# EAGLE design duckypad (EAGLE 9.6.2)
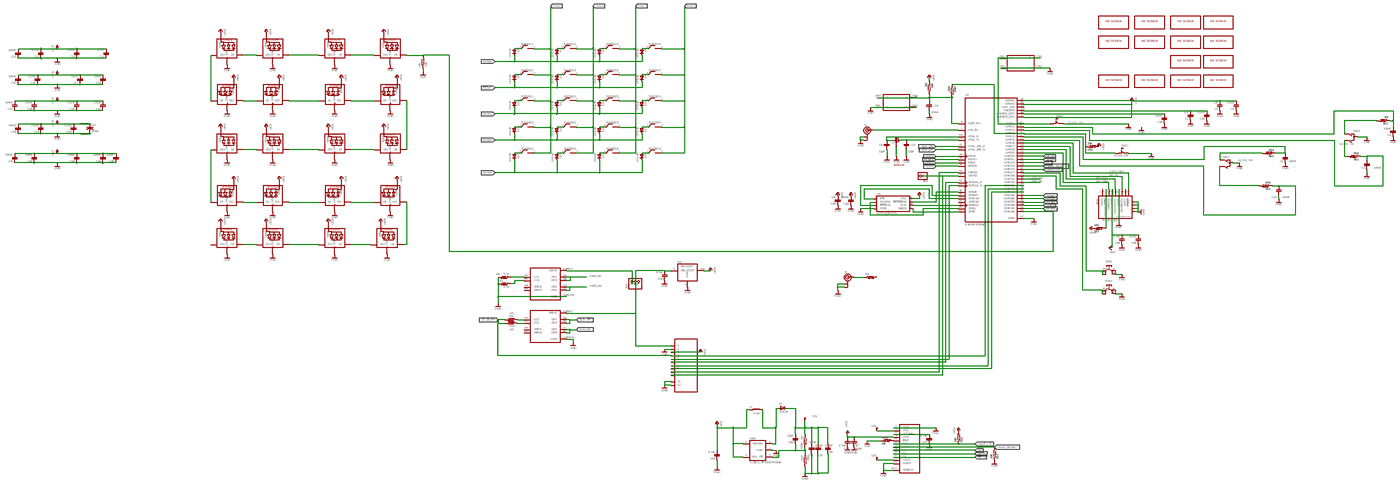
[diagram p0: schematic, sheet 1, overview]
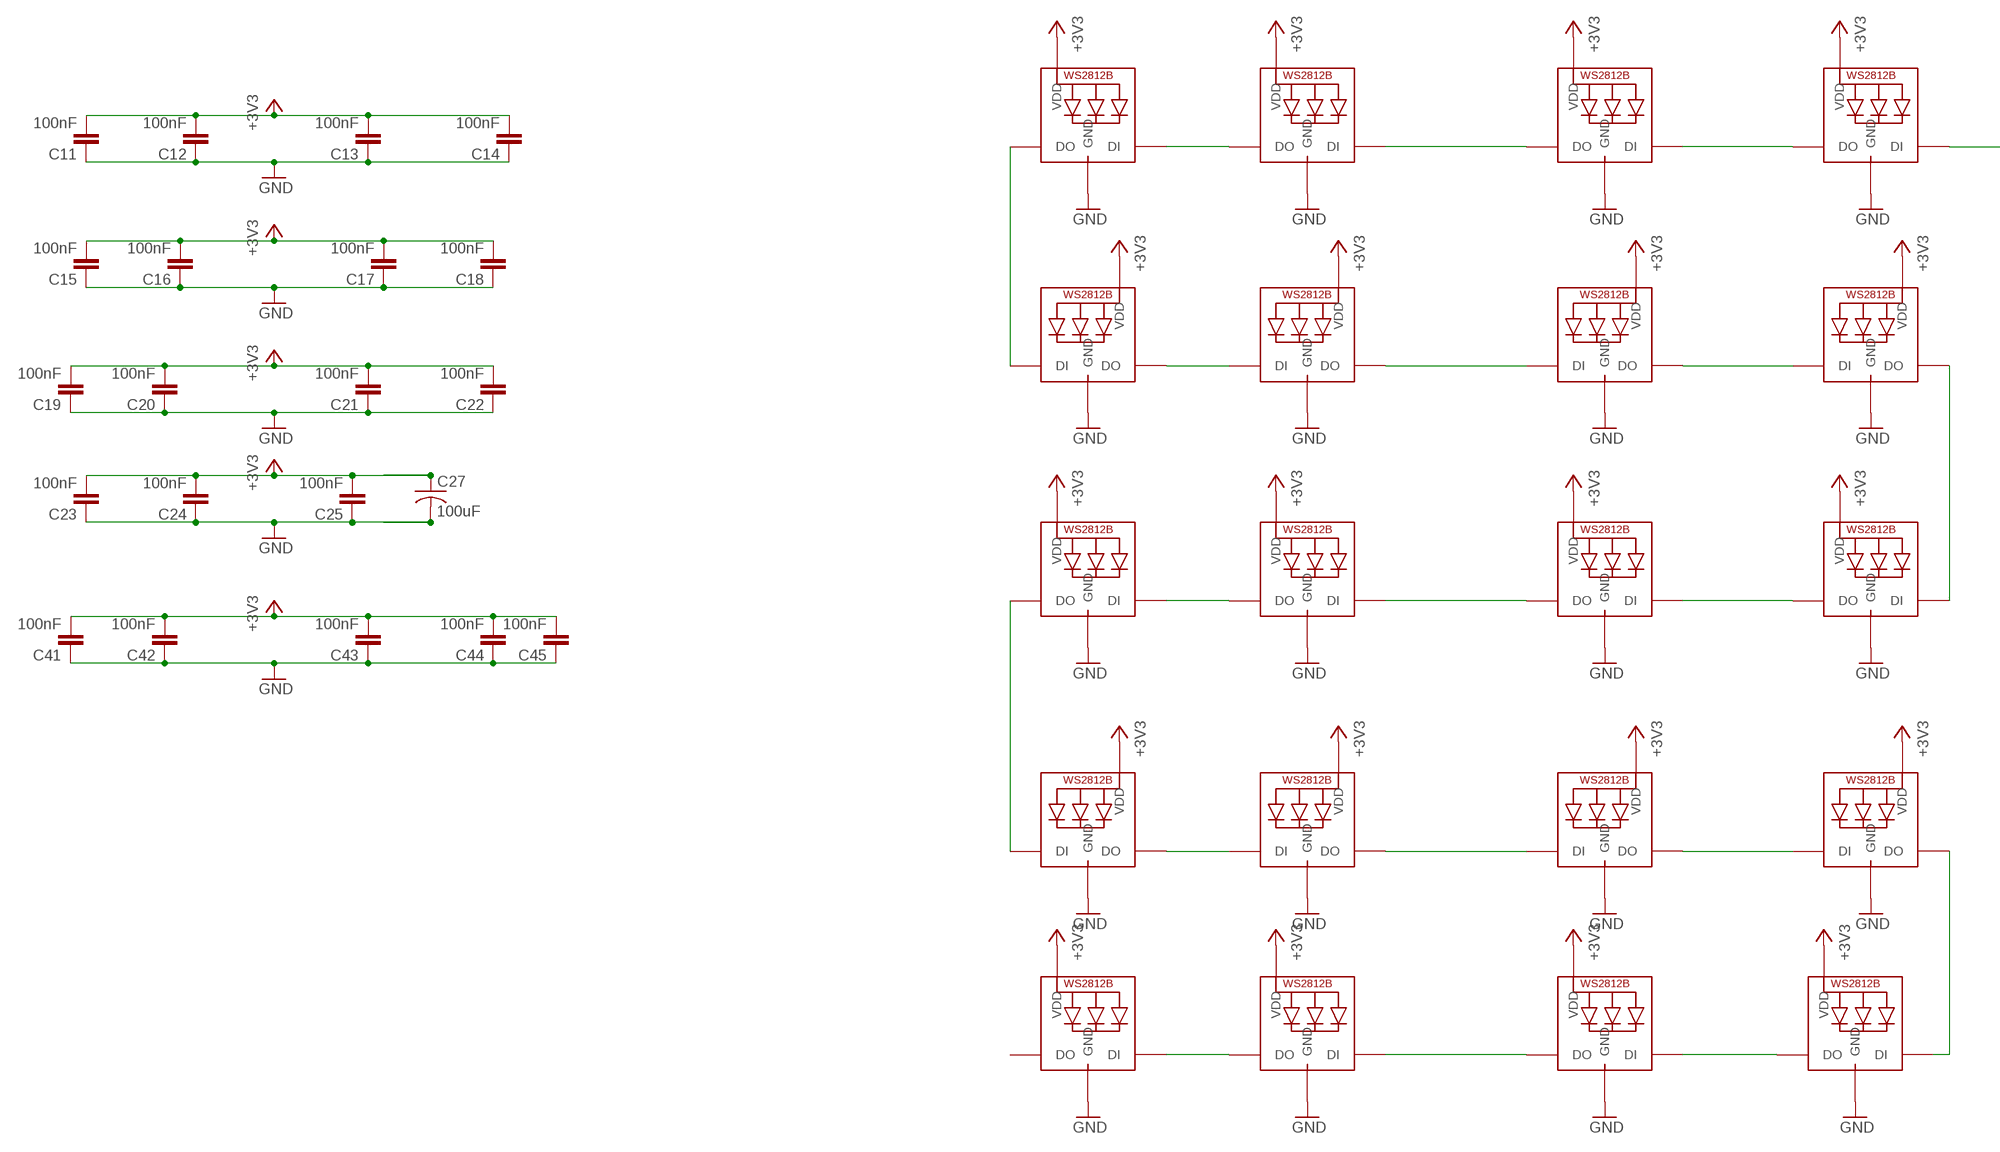
[diagram p1: schematic, sheet 1, part 1 of 4]
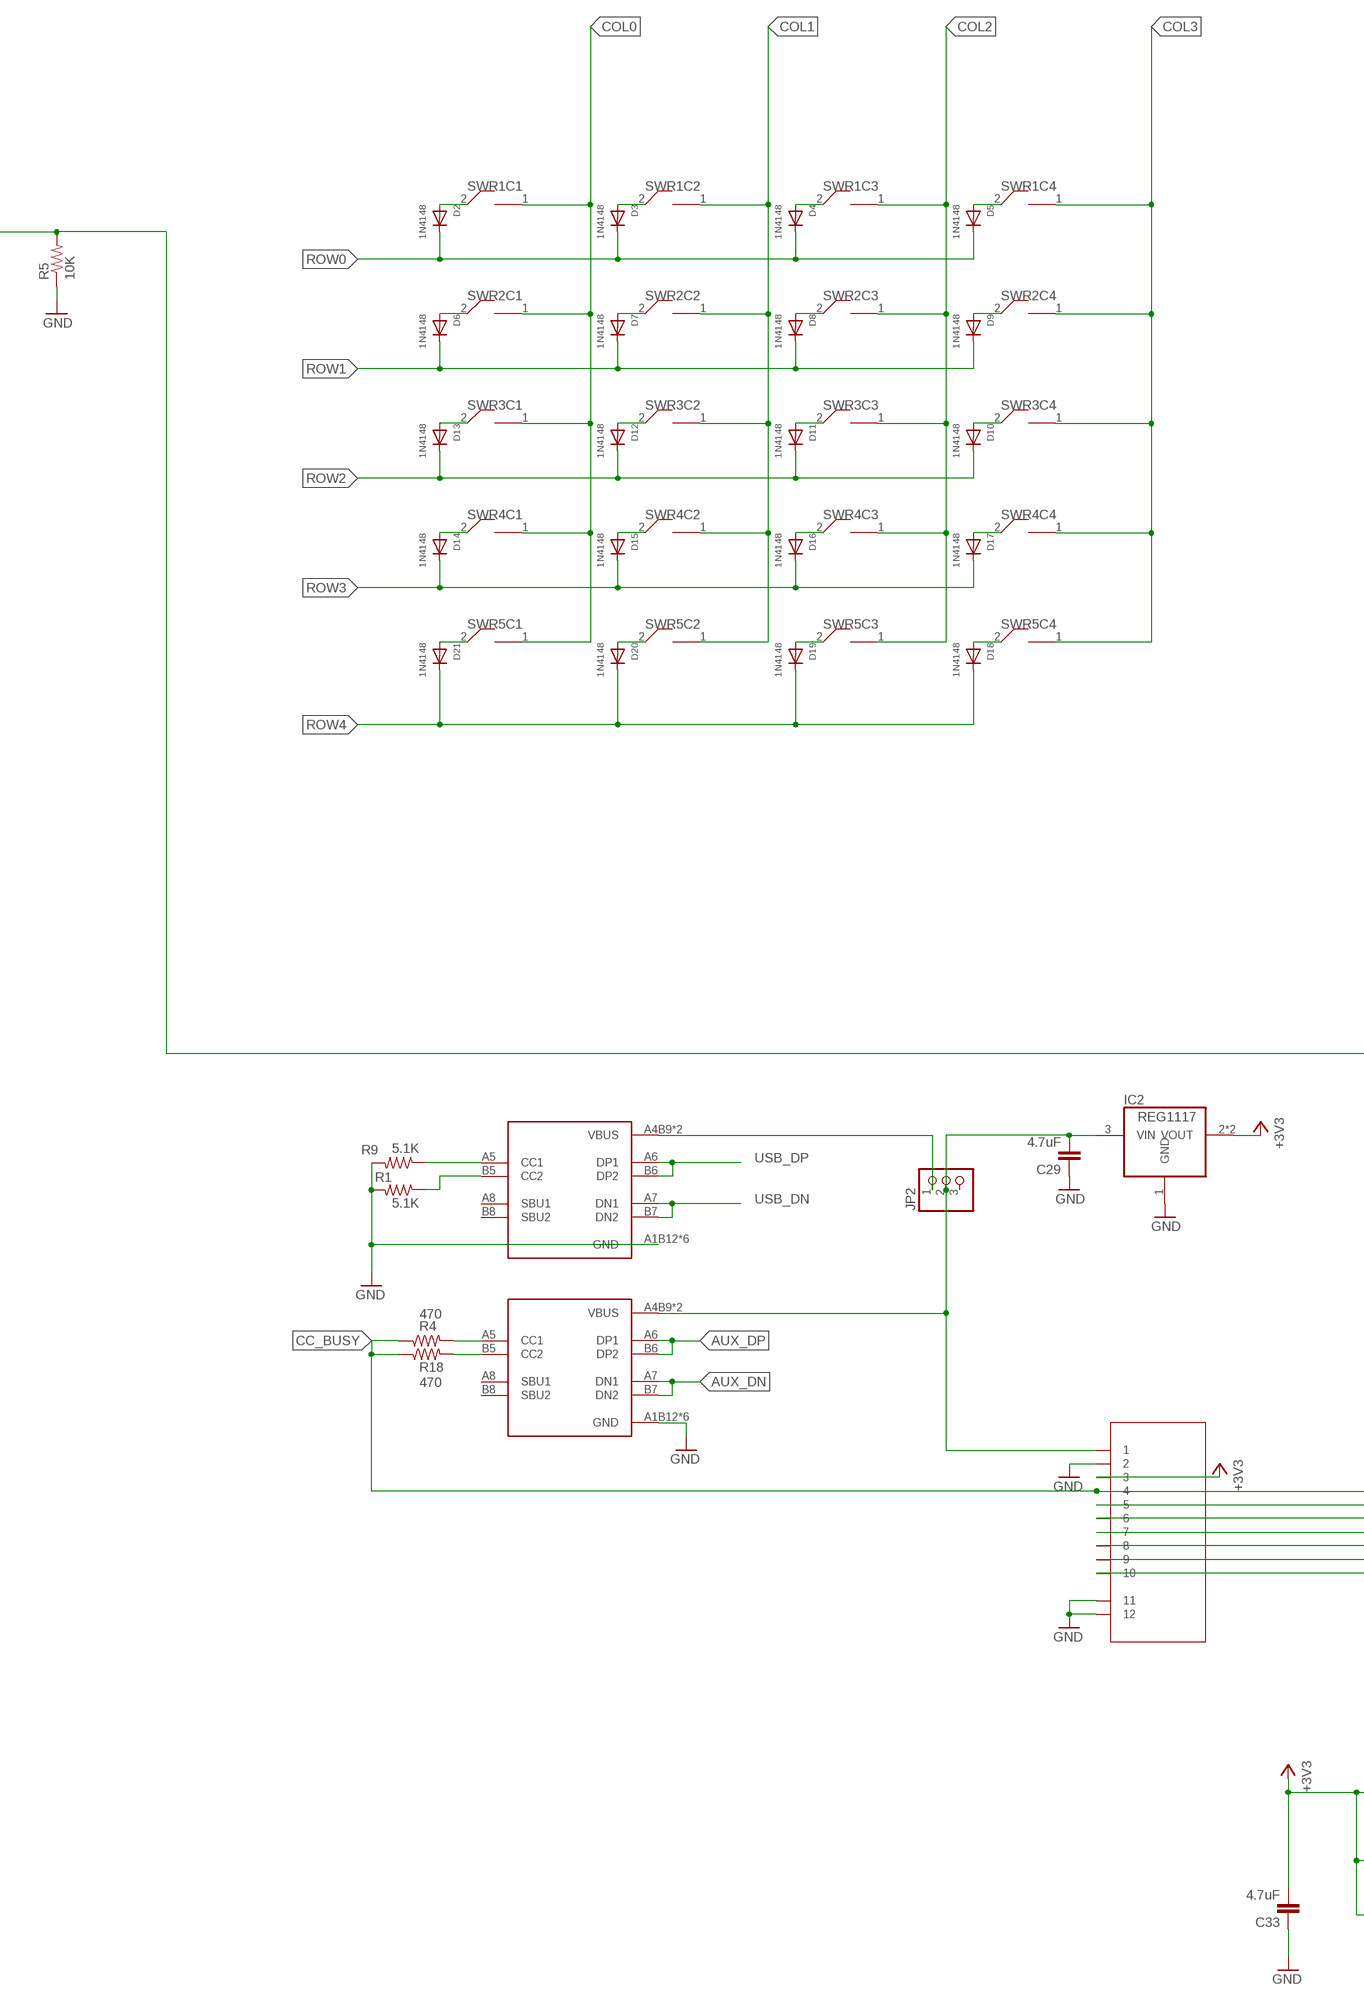
[diagram p2: schematic, sheet 1, part 2 of 4]
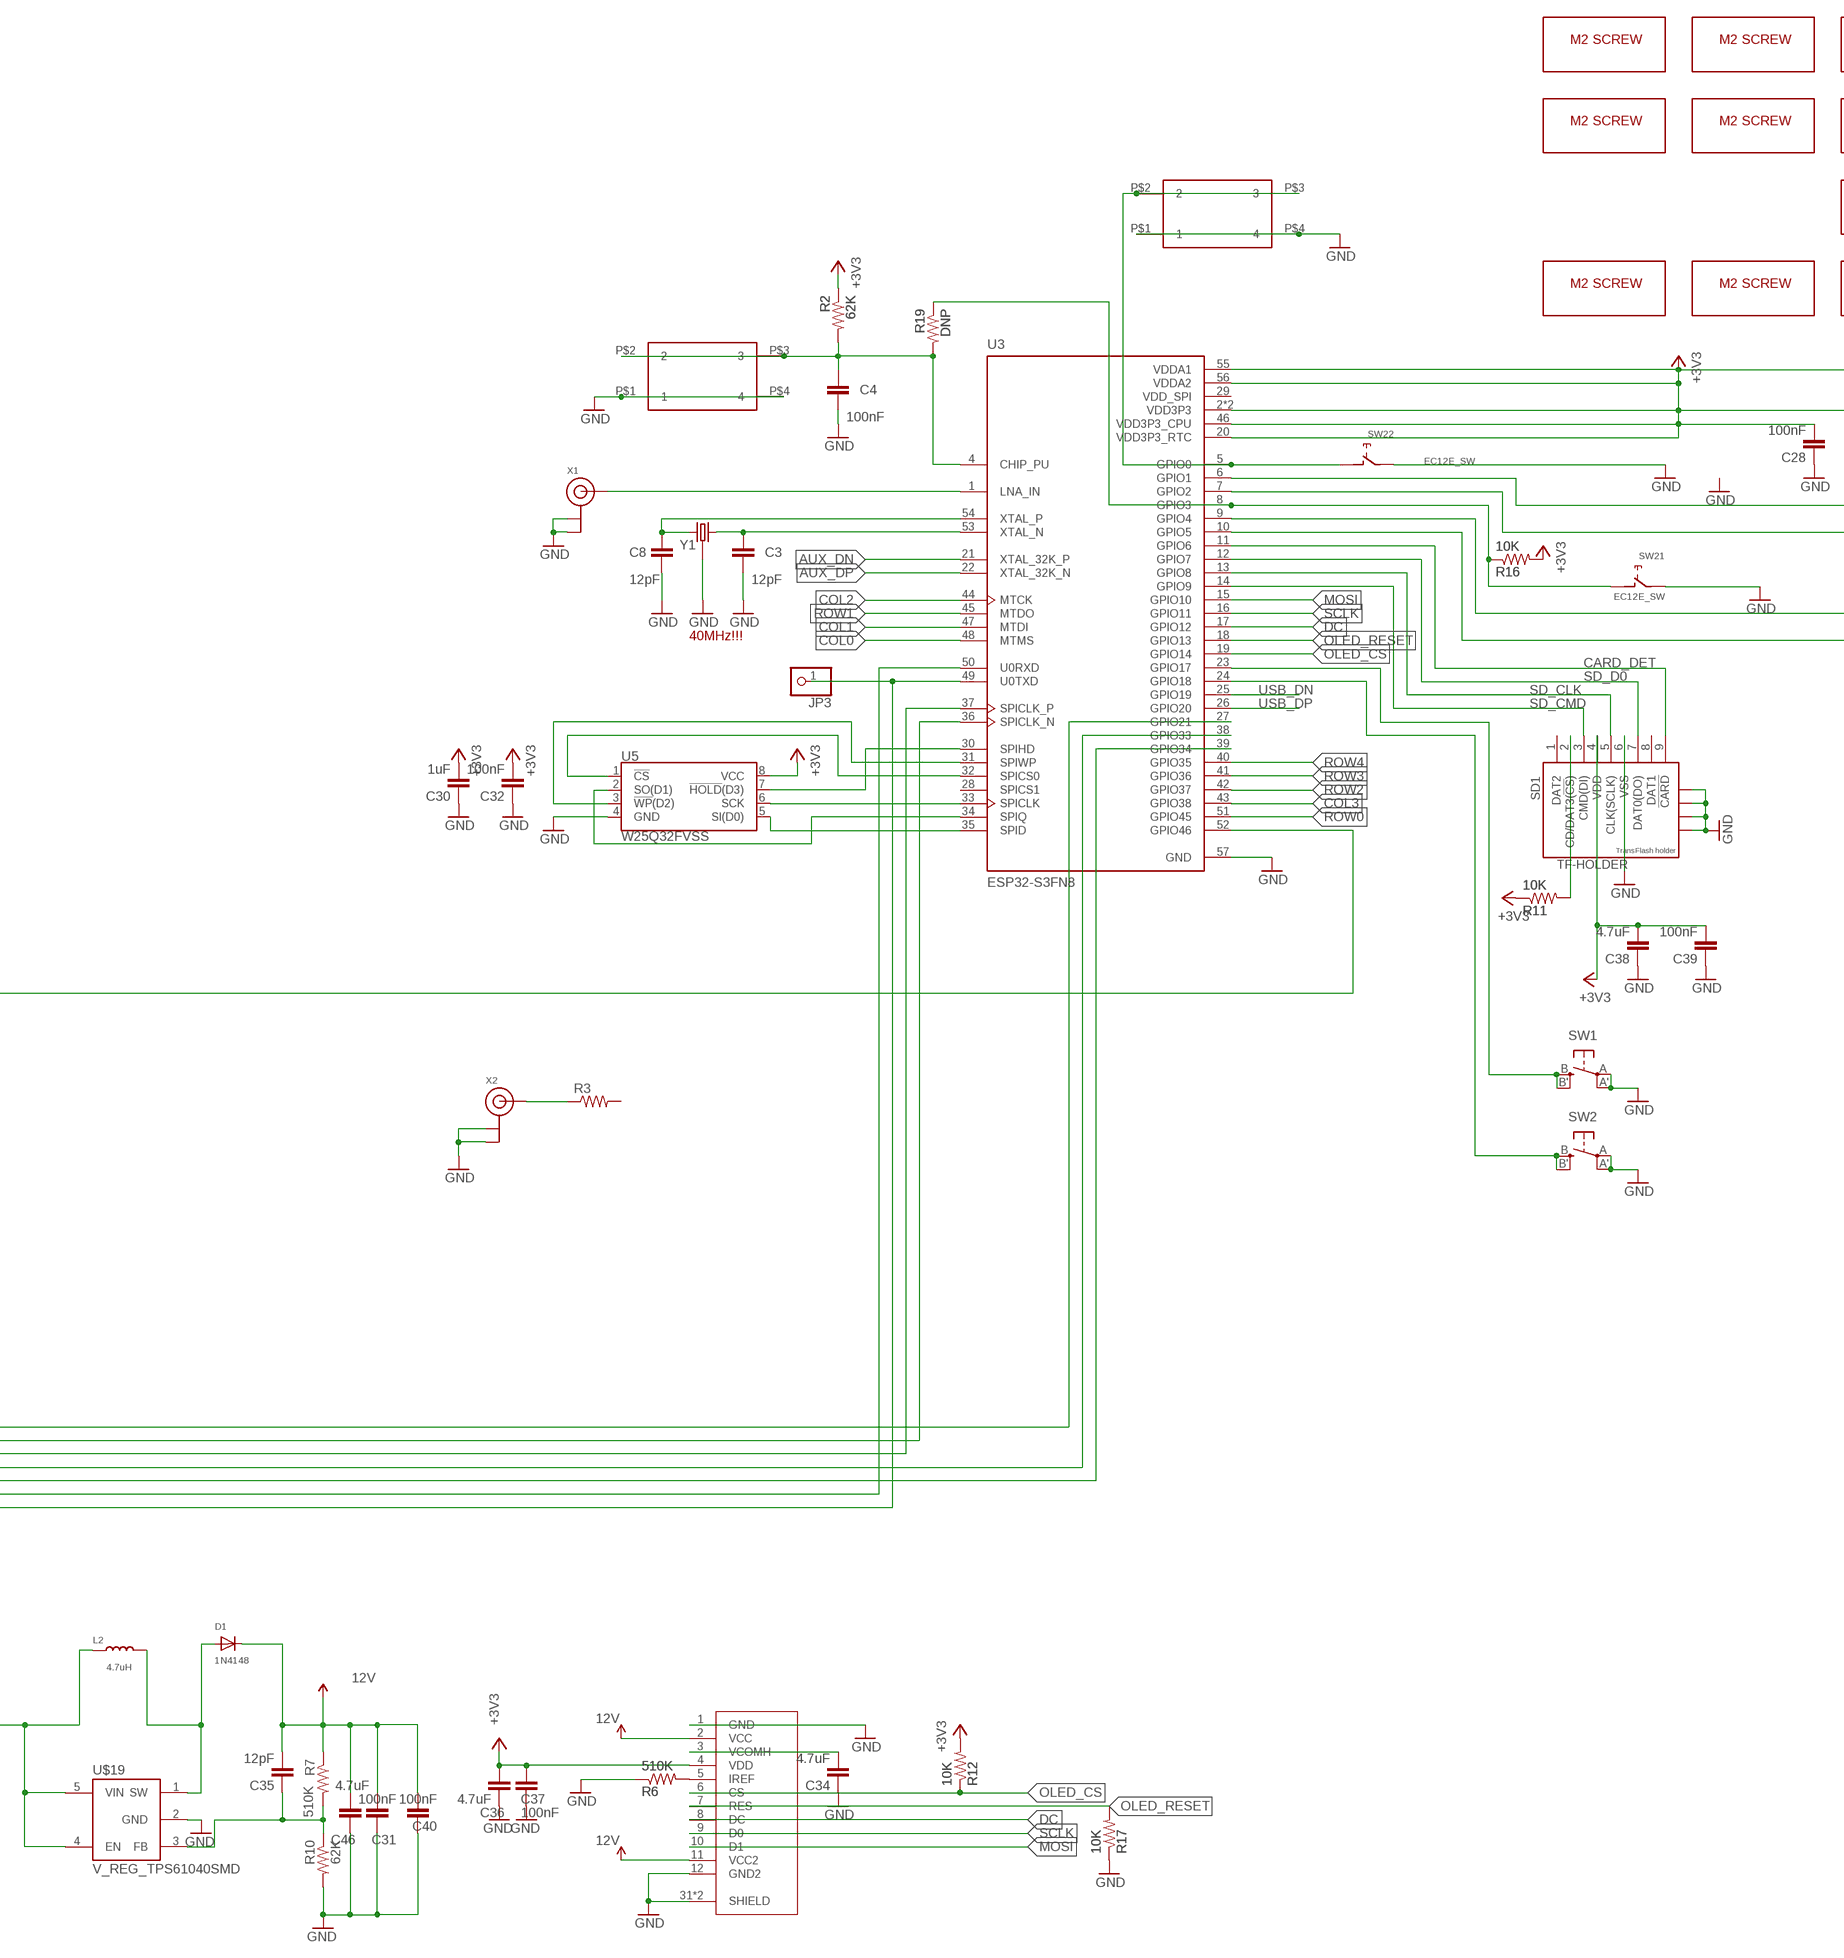
[diagram p3: schematic, sheet 1, part 3 of 4]
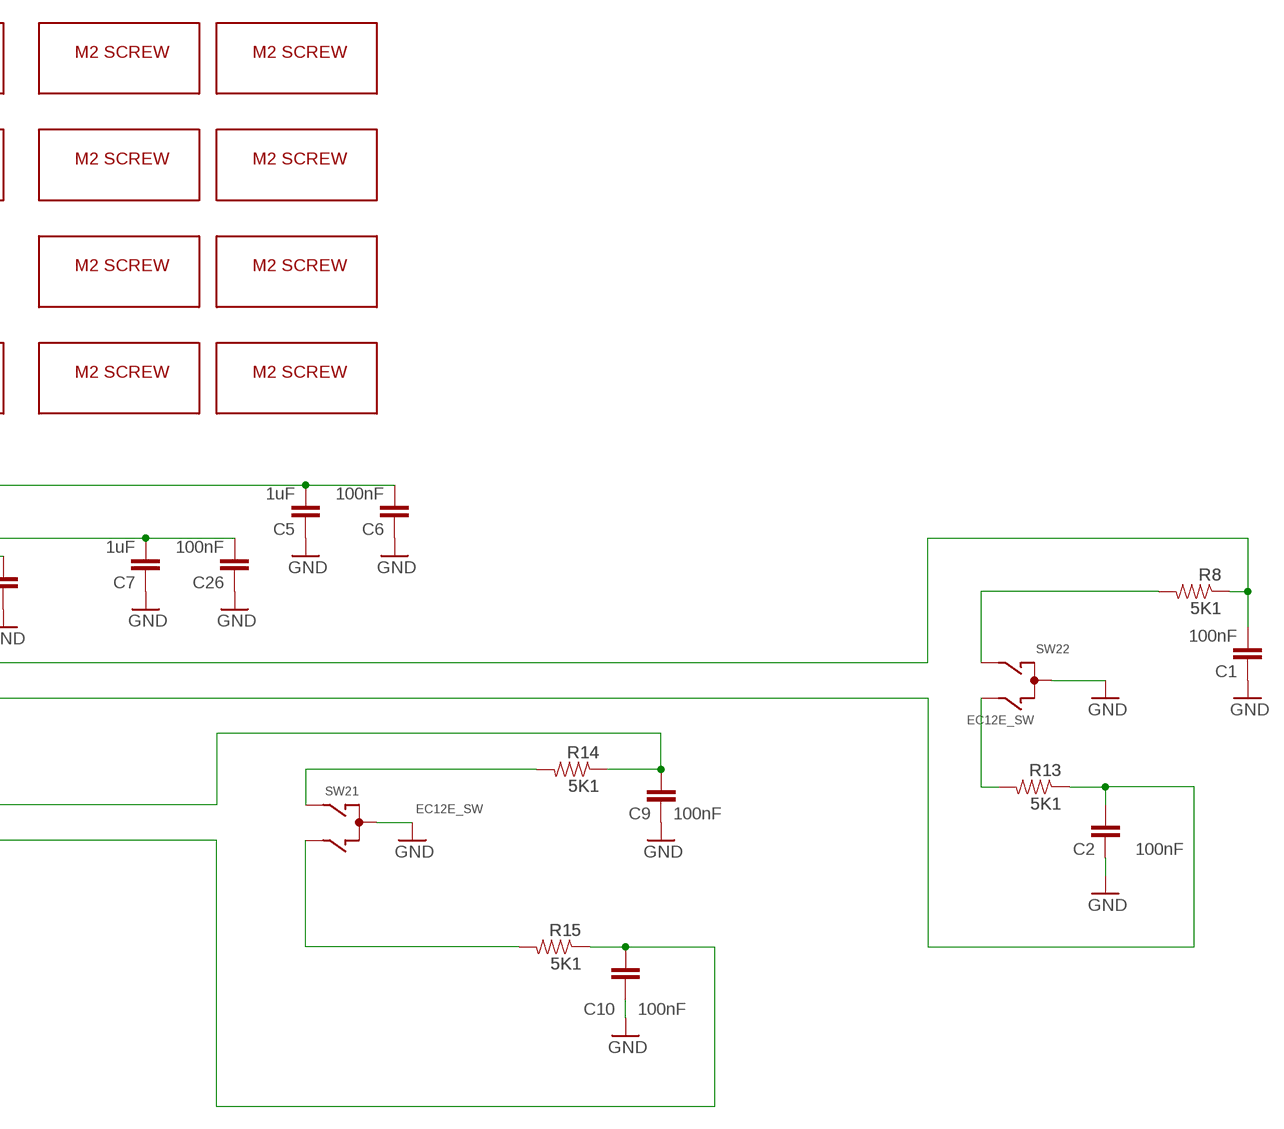
[diagram p4: schematic, sheet 1, part 4 of 4]

## Parts
C1  100nF  CAP0805  [0805]
C2  100nF  CAP0805  [0805]
C3  12pF  CAP0805  [0805]
C4  100nF  CAP0805  [0805]
C5  1uF  CAP0805  [0805]
C6  100nF  CAP0805  [0805]
C7  1uF  CAP0805  [0805]
C8  12pF  CAP0805  [0805]
C9  100nF  CAP0805  [0805]
C10  100nF  CAP0805  [0805]
C11  100nF  CAP0805  [0805]
C12  100nF  CAP0805  [0805]
C13  100nF  CAP0805  [0805]
C14  100nF  CAP0805  [0805]
C15  100nF  CAP0805  [0805]
C16  100nF  CAP0805  [0805]
C17  100nF  CAP0805  [0805]
C18  100nF  CAP0805  [0805]
C19  100nF  CAP0805  [0805]
C20  100nF  CAP0805  [0805]
C21  100nF  CAP0805  [0805]
C22  100nF  CAP0805  [0805]
C23  100nF  CAP0805  [0805]
C24  100nF  CAP0805  [0805]
C25  100nF  CAP0805  [0805]
C26  100nF  CAP0805  [0805]
C27  100uF  C-USC1210  [C1210]
C28  100nF  CAP0805  [0805]
C29  4.7uF  CAP0805  [0805]
C30  1uF  CAP0805  [0805]
C31  100nF  CAP0805  [0805]
C32  100nF  CAP0805  [0805]
C33  4.7uF  CAP0805  [0805]
C34  4.7uF  CAP0805  [0805]
C35  12pF  CAP0805  [0805]
C36  4.7uF  CAP0805  [0805]
C37  100nF  CAP0805  [0805]
C38  4.7uF  CAP0805  [0805]
C39  100nF  CAP0805  [0805]
C40  100nF  CAP0805  [0805]
C41  100nF  CAP0805  [0805]
C42  100nF  CAP0805  [0805]
C43  100nF  CAP0805  [0805]
C44  100nF  CAP0805  [0805]
C45  100nF  CAP0805  [0805]
C46  4.7uF  CAP0805  [0805]
D1  1N4148  ADAFRUIT_CHANGED_DIODESOD-123  [ADAFRUIT_CHANGED_SOD-123]
D2  1N4148  ADAFRUIT_CHANGED_DIODESOD-123  [ADAFRUIT_CHANGED_SOD-123]
D3  1N4148  ADAFRUIT_CHANGED_DIODESOD-123  [ADAFRUIT_CHANGED_SOD-123]
D4  1N4148  ADAFRUIT_CHANGED_DIODESOD-123  [ADAFRUIT_CHANGED_SOD-123]
D5  1N4148  ADAFRUIT_CHANGED_DIODESOD-123  [ADAFRUIT_CHANGED_SOD-123]
D6  1N4148  ADAFRUIT_CHANGED_DIODESOD-123  [ADAFRUIT_CHANGED_SOD-123]
D7  1N4148  ADAFRUIT_CHANGED_DIODESOD-123  [ADAFRUIT_CHANGED_SOD-123]
D8  1N4148  ADAFRUIT_CHANGED_DIODESOD-123  [ADAFRUIT_CHANGED_SOD-123]
D9  1N4148  ADAFRUIT_CHANGED_DIODESOD-123  [ADAFRUIT_CHANGED_SOD-123]
D10  1N4148  ADAFRUIT_CHANGED_DIODESOD-123  [ADAFRUIT_CHANGED_SOD-123]
D11  1N4148  ADAFRUIT_CHANGED_DIODESOD-123  [ADAFRUIT_CHANGED_SOD-123]
D12  1N4148  ADAFRUIT_CHANGED_DIODESOD-123  [ADAFRUIT_CHANGED_SOD-123]
D13  1N4148  ADAFRUIT_CHANGED_DIODESOD-123  [ADAFRUIT_CHANGED_SOD-123]
D14  1N4148  ADAFRUIT_CHANGED_DIODESOD-123  [ADAFRUIT_CHANGED_SOD-123]
D15  1N4148  ADAFRUIT_CHANGED_DIODESOD-123  [ADAFRUIT_CHANGED_SOD-123]
D16  1N4148  ADAFRUIT_CHANGED_DIODESOD-123  [ADAFRUIT_CHANGED_SOD-123]
D17  1N4148  ADAFRUIT_CHANGED_DIODESOD-123  [ADAFRUIT_CHANGED_SOD-123]
D18  1N4148  ADAFRUIT_CHANGED_DIODESOD-123  [ADAFRUIT_CHANGED_SOD-123]
D19  1N4148  ADAFRUIT_CHANGED_DIODESOD-123  [ADAFRUIT_CHANGED_SOD-123]
D20  1N4148  ADAFRUIT_CHANGED_DIODESOD-123  [ADAFRUIT_CHANGED_SOD-123]
D21  1N4148  ADAFRUIT_CHANGED_DIODESOD-123  [ADAFRUIT_CHANGED_SOD-123]
IC2  REG1117  [SOT223]
JP2  PINHD-1X3CB  [1X03-CLEANBIG]
JP3  PINHD-1X1CB  [1X01-CLEANBIG]
L2  4.7uH  L-4030  [L4030]
LED_R1C1  WS2812B  [REVERSE_MNT]
LED_R1C2  WS2812B  [REVERSE_MNT]
LED_R1C3  WS2812B  [REVERSE_MNT]
LED_R1C4  WS2812B  [REVERSE_MNT]
LED_R2C1  WS2812B  [REVERSE_MNT]
LED_R2C2  WS2812B  [REVERSE_MNT]
LED_R2C3  WS2812B  [REVERSE_MNT]
LED_R2C4  WS2812B  [REVERSE_MNT]
LED_R3C1  WS2812B  [REVERSE_MNT]
LED_R3C2  WS2812B  [REVERSE_MNT]
LED_R3C3  WS2812B  [REVERSE_MNT]
LED_R3C4  WS2812B  [REVERSE_MNT]
LED_R4C1  WS2812B  [REVERSE_MNT]
LED_R4C2  WS2812B  [REVERSE_MNT]
LED_R4C3  WS2812B  [REVERSE_MNT]
LED_R4C4  WS2812B  [REVERSE_MNT]
LED_R5C1  WS2812B  [REVERSE_MNT]
LED_R5C2  WS2812B  [REVERSE_MNT]
LED_R5C3  WS2812B  [REVERSE_MNT]
LED_R5C4  WS2812B  [REVERSE_MNT]
R1  5.1K  RESISTOR0805-RES  [0805]
R2  62K  RESISTOR0805-RES  [0805]
R3  R-US_R2010  [R2010]
R4  470  RESISTOR0805-RES  [0805]
R5  10K  RESISTOR0805-RES  [0805]
R6  510K  RESISTOR0805-RES  [0805]
R7  510K  RESISTOR0805-RES  [0805]
R8  5K1  RESISTOR0805-RES  [0805]
R9  5.1K  RESISTOR0805-RES  [0805]
R10  62K  RESISTOR0805-RES  [0805]
R11  10K  RESISTOR0805-RES  [0805]
R12  10K  RESISTOR0805-RES  [0805]
R13  5K1  RESISTOR0805-RES  [0805]
R14  5K1  RESISTOR0805-RES  [0805]
R15  5K1  RESISTOR0805-RES  [0805]
R16  10K  RESISTOR0805-RES  [0805]
R17  10K  RESISTOR0805-RES  [0805]
R18  470  RESISTOR0805-RES  [0805]
R19  DNP  RESISTOR0805-RES  [0805]
SD1  TF-HOLDER  [TF-PULL]
SW1  SPST_TACT-EVQQ2  [EVQ-Q2]
SW2  SPST_TACT-EVQQ2  [EVQ-Q2]
SW3  324_SW324_SWITCH_FOOT_HOLE  [342_SWICH_FOOT_HOLE]
SW4  324_SW324_SWITCH_FOOT_HOLE  [342_SWICH_FOOT_HOLE]
SW21  EC12E_SW  [ALPS_EC12E_SW]
SW22  EC12E_SW  [ALPS_EC12E_SW]
SWR1C1  KAILH_SWITCH_SOCKET_KAILH_SWITCH_SOCKET  [KAILH_SWITCH_SOCKET_SWITCH_SOCKET]
SWR1C2  KAILH_SWITCH_SOCKET_KAILH_SWITCH_SOCKET  [KAILH_SWITCH_SOCKET_SWITCH_SOCKET]
SWR1C3  KAILH_SWITCH_SOCKET_KAILH_SWITCH_SOCKET  [KAILH_SWITCH_SOCKET_SWITCH_SOCKET]
SWR1C4  KAILH_SWITCH_SOCKET_KAILH_SWITCH_SOCKET  [KAILH_SWITCH_SOCKET_SWITCH_SOCKET]
SWR2C1  KAILH_SWITCH_SOCKET_KAILH_SWITCH_SOCKET  [KAILH_SWITCH_SOCKET_SWITCH_SOCKET]
SWR2C2  KAILH_SWITCH_SOCKET_KAILH_SWITCH_SOCKET  [KAILH_SWITCH_SOCKET_SWITCH_SOCKET]
SWR2C3  KAILH_SWITCH_SOCKET_KAILH_SWITCH_SOCKET  [KAILH_SWITCH_SOCKET_SWITCH_SOCKET]
SWR2C4  KAILH_SWITCH_SOCKET_KAILH_SWITCH_SOCKET  [KAILH_SWITCH_SOCKET_SWITCH_SOCKET]
SWR3C1  KAILH_SWITCH_SOCKET_KAILH_SWITCH_SOCKET  [KAILH_SWITCH_SOCKET_SWITCH_SOCKET]
SWR3C2  KAILH_SWITCH_SOCKET_KAILH_SWITCH_SOCKET  [KAILH_SWITCH_SOCKET_SWITCH_SOCKET]
SWR3C3  KAILH_SWITCH_SOCKET_KAILH_SWITCH_SOCKET  [KAILH_SWITCH_SOCKET_SWITCH_SOCKET]
SWR3C4  KAILH_SWITCH_SOCKET_KAILH_SWITCH_SOCKET  [KAILH_SWITCH_SOCKET_SWITCH_SOCKET]
SWR4C1  KAILH_SWITCH_SOCKET_KAILH_SWITCH_SOCKET  [KAILH_SWITCH_SOCKET_SWITCH_SOCKET]
SWR4C2  KAILH_SWITCH_SOCKET_KAILH_SWITCH_SOCKET  [KAILH_SWITCH_SOCKET_SWITCH_SOCKET]
SWR4C3  KAILH_SWITCH_SOCKET_KAILH_SWITCH_SOCKET  [KAILH_SWITCH_SOCKET_SWITCH_SOCKET]
SWR4C4  KAILH_SWITCH_SOCKET_KAILH_SWITCH_SOCKET  [KAILH_SWITCH_SOCKET_SWITCH_SOCKET]
SWR5C1  KAILH_SWITCH_SOCKET_KAILH_SWITCH_SOCKET  [KAILH_SWITCH_SOCKET_SWITCH_SOCKET]
SWR5C2  KAILH_SWITCH_SOCKET_KAILH_SWITCH_SOCKET  [KAILH_SWITCH_SOCKET_SWITCH_SOCKET]
SWR5C3  KAILH_SWITCH_SOCKET_KAILH_SWITCH_SOCKET  [KAILH_SWITCH_SOCKET_SWITCH_SOCKET]
SWR5C4  KAILH_SWITCH_SOCKET_KAILH_SWITCH_SOCKET  [KAILH_SWITCH_SOCKET_SWITCH_SOCKET]
U1  USBC_16P  [USBC_16P_FOOT]
U2  USBC_16P  [USBC_16P_FOOT]
U3  ESP32-S3FN8  [QFN40P700X700X90-57N]
U5  W25Q32FVSS  [SOIC-8]
U$2  OLED128  [LUL_UG-2864HSWEG01_1.3_WRAPAROUND]
U$3  SH10P  [DUCKYPAD_SM12B-SSR-H-TB]
U$7  M2_SCREW_DEV  [M2_SCREW_FOOT]
U$8  M2_SCREW_DEV  [M2_SCREW_FOOT]
U$9  M2_SCREW_DEV  [M2_SCREW_FOOT]
U$10  M2_SCREW_DEV  [M2_SCREW_FOOT]
U$11  M2_SCREW_DEV  [M2_SCREW_FOOT]
U$12  M2_SCREW_DEV  [M2_SCREW_FOOT]
U$13  M2_SCREW_DEV  [M2_SCREW_FOOT]
U$14  M2_SCREW_DEV  [M2_SCREW_FOOT]
U$15  M2_SCREW_DEV  [M2_SCREW_FOOT]
U$16  M2_SCREW_DEV  [M2_SCREW_FOOT]
U$17  M2_SCREW_DEV  [M2_SCREW_FOOT]
U$19  V_REG_TPS61040SMD  [SOT23-5]
U$20  M2_SCREW_DEV  [M2_SCREW_FOOT]
U$21  M2_SCREW_DEV  [M2_SCREW_FOOT]
U$22  M2_SCREW_DEV  [M2_SCREW_FOOT]
X1  ANTENNA_U.FL  [U.FL]
X2  ANTENNA_U.FL  [U.FL]
Y1  16MHz_12pF  CRYSTAL-26MHZSMD-3.2X2.5  [CRYSTAL-SMD-3.2X2.5MM]

## Nets
12V: C31.2 C35.2 C40.2 C46.2 D1.C R7.1 U$2.2(VCC) U$2.11(VCC2)
+3V3: C5.2 C6.2 C7.2 C11.2 C12.2 C13.2 C14.2 C15.2 C16.2 C17.2 C18.2 C19.2 C20.2 C21.2 C22.2 C23.2 C24.2 C25.2 C26.2 C27.1 C28.2 C30.2 C32.2 C33.2 C36.2 C37.2 C38.2 C39.2 C41.2 C42.2 C43.2 C44.2 C45.2 IC2.2(VOUT) IC2.4(VOUT) L2.1 LED_R1C1.VDD LED_R1C2.VDD LED_R1C3.VDD LED_R1C4.VDD LED_R2C1.VDD LED_R2C2.VDD LED_R2C3.VDD LED_R2C4.VDD LED_R3C1.VDD LED_R3C2.VDD LED_R3C3.VDD LED_R3C4.VDD LED_R4C1.VDD LED_R4C2.VDD LED_R4C3.VDD LED_R4C4.VDD LED_R5C1.VDD LED_R5C2.VDD LED_R5C3.VDD LED_R5C4.VDD R2.1 R11.1 R12.2 R16.2 SD1.4(VDD) U3.2(VDD3P3) U3.3(VDD3P3) U3.20(VDD3P3_RTC) U3.46(VDD3P3_CPU) U3.55(VDDA1) U3.56(VDDA2) U5.8(VCC) U$2.4(VDD) U$3.3 U$19.4(EN) U$19.5(VIN)
AUX_DN: U1.A7(DN1) U1.B7(DN2) U3.21(XTAL_32K_P)
AUX_DP: U1.A6(DP1) U1.B6(DP2) U3.22(XTAL_32K_N)
CARD_DET: SD1.9(!CARD) U3.11(GPIO6)
CC_BUSY: R4.1 R18.1 U3.27(GPIO21) U$3.4
COL0: SWR1C1.1 SWR2C1.1 SWR3C1.1 SWR4C1.1 SWR5C1.1 U3.48(MTMS)
COL1: SWR1C2.1 SWR2C2.1 SWR3C2.1 SWR4C2.1 SWR5C2.1 U3.47(MTDI)
COL2: SWR1C3.1 SWR2C3.1 SWR3C3.1 SWR4C3.1 SWR5C3.1 U3.44(MTCK)
COL3: SWR1C4.1 SWR2C4.1 SWR3C4.1 SWR4C4.1 SWR5C4.1 U3.43(GPIO38)
DC: U3.17(GPIO12) U$2.8(DC)
GND: C1.1 C2.1 C3.2 C4.2 C5.1 C6.1 C7.1 C8.2 C9.1 C10.1 C11.1 C12.1 C13.1 C14.1 C15.1 C16.1 C17.1 C18.1 C19.1 C20.1 C21.1 C22.1 C23.1 C24.1 C25.1 C26.1 C27.2 C28.1 C29.1 C30.1 C31.1 C32.1 C33.1 C34.1 C36.1 C37.1 C38.1 C39.1 C40.1 C41.1 C42.1 C43.1 C44.1 C45.1 C46.1 IC2.1(GND) LED_R1C1.GND LED_R1C2.GND LED_R1C3.GND LED_R1C4.GND LED_R2C1.GND LED_R2C2.GND LED_R2C3.GND LED_R2C4.GND LED_R3C1.GND LED_R3C2.GND LED_R3C3.GND LED_R3C4.GND LED_R4C1.GND LED_R4C2.GND LED_R4C3.GND LED_R4C4.GND LED_R5C1.GND LED_R5C2.GND LED_R5C3.GND LED_R5C4.GND R1.2 R5.1 R6.1 R9.2 R10.2 R17.1 SD1.6(VSS) SD1.S1 SD1.S2 SD1.S3 SD1.S4 SW1.A'(P1) SW1.A(P) SW2.A'(P1) SW2.A(P) SW3.P$1 SW3.P$4 SW4.P$1 SW4.P$4 SW21.C SW21.E SW22.C SW22.E U1.A1B12(GND) U1.B11A12(GND) U1.P$13(GND) U1.P$14(GND) U1.P$15(GND) U1.P$16(GND) U2.A1B12(GND) U2.B11A12(GND) U2.P$13(GND) U2.P$14(GND) U2.P$15(GND) U2.P$16(GND) U3.57(GND) U5.4(GND) U$2.1(GND) U$2.12(GND2) U$2.31(SHIELD) U$2.32(SHIELD) U$3.2 U$3.FIT@1 U$3.FIT@2 U$19.2(GND) X1.1(GND) X1.2(GND) X2.1(GND) X2.2(GND) Y1.2 Y1.4
MOSI: U3.15(GPIO10) U$2.10(D1)
N$1: JP2.1 U2.A4B9(VBUS) U2.B4A9(VBUS)
N$2: LED_R1C3.DIN(DI) LED_R1C4.DOUT(DO)
N$3: LED_R1C2.DIN(DI) LED_R1C3.DOUT(DO)
N$4: LED_R1C1.DIN(DI) LED_R1C2.DOUT(DO)
N$5: LED_R1C1.DOUT(DO) LED_R2C1.DIN(DI)
N$6: LED_R2C1.DOUT(DO) LED_R2C2.DIN(DI)
N$7: LED_R2C2.DOUT(DO) LED_R2C3.DIN(DI)
N$8: C34.2 U$2.3(VCOMH)
N$9: LED_R2C3.DOUT(DO) LED_R2C4.DIN(DI)
N$10: R6.2 U$2.5(IREF)
N$11: LED_R2C4.DOUT(DO) LED_R3C4.DIN(DI)
N$12: LED_R3C3.DIN(DI) LED_R3C4.DOUT(DO)
N$13: LED_R3C2.DIN(DI) LED_R3C3.DOUT(DO)
N$14: C9.2 R14.1 U3.9(GPIO4)
N$15: LED_R3C1.DIN(DI) LED_R3C2.DOUT(DO)
N$16: LED_R3C1.DOUT(DO) LED_R4C1.DIN(DI)
N$17: LED_R4C1.DOUT(DO) LED_R4C2.DIN(DI)
N$18: LED_R4C2.DOUT(DO) LED_R4C3.DIN(DI)
N$19: LED_R4C3.DOUT(DO) LED_R4C4.DIN(DI)
N$20: LED_R4C4.DOUT(DO) LED_R5C4.DIN(DI)
N$21: LED_R5C3.DIN(DI) LED_R5C4.DOUT(DO)
N$22: LED_R5C2.DIN(DI) LED_R5C3.DOUT(DO)
N$23: LED_R5C1.DIN(DI) LED_R5C2.DOUT(DO)
N$24: C8.1 U3.54(XTAL_P) Y1.1
N$25: C3.1 U3.53(XTAL_N) Y1.3
N$26: U3.1(LNA_IN) X1.3(SIGNAL)
N$27: D5.A SWR1C4.2
N$28: SW4.P$2 SW4.P$3 SW22.D U3.5(GPIO0)
N$29: LED_R1C4.DIN(DI) R5.2 U3.52(GPIO46)
N$30: SW1.B'(S1) SW1.B(S) U3.23(GPIO17)
N$31: R1.1 U2.B5(CC2)
N$32: R4.2 U1.A5(CC1)
N$33: R9.1 U2.A5(CC1)
N$34: R8.2 SW22.A
N$35: R13.2 SW22.B
N$36: D1.A L2.2 U$19.1(SW)
N$38: C1.2 R8.1 U3.6(GPIO1)
N$39: C35.1 R7.2 R10.1 U$19.3(FB)
N$40: C2.2 R13.1 U3.7(GPIO2)
N$41: R16.1 R19.1 SW21.D U3.8(GPIO3)
N$42: R15.2 SW21.B
N$43: R11.2 SD1.2(CD/DAT3(!CS!))
N$44: D4.A SWR1C3.2
N$45: D3.A SWR1C2.2
N$46: D2.A SWR1C1.2
N$47: D9.A SWR2C4.2
N$48: R14.2 SW21.A
N$49: C10.2 R15.1 U3.10(GPIO5)
N$50: D8.A SWR2C3.2
N$51: D7.A SWR2C2.2
N$52: D6.A SWR2C1.2
N$53: D10.A SWR3C4.2
N$54: D11.A SWR3C3.2
N$55: D12.A SWR3C2.2
N$56: D13.A SWR3C1.2
N$57: D17.A SWR4C4.2
N$58: D16.A SWR4C3.2
N$59: D15.A SWR4C2.2
N$60: D14.A SWR4C1.2
N$61: D18.A SWR5C4.2
N$62: D19.A SWR5C3.2
N$63: D20.A SWR5C2.2
N$64: D21.A SWR5C1.2
N$65: SW2.B'(S1) SW2.B(S) U3.24(GPIO18)
N$66: C29.2 IC2.3(VIN) JP2.2 U1.A4B9(VBUS) U1.B4A9(VBUS) U$3.1
N$67: U3.36(SPICLK_N) U$3.5
N$68: U3.37(SPICLK_P) U$3.6
N$69: U3.38(GPIO33) U$3.7
N$70: U3.39(GPIO34) U$3.8
N$71: R3.1 X2.3(SIGNAL)
N$72: U3.50(U0RXD) U$3.9
N$73: JP3.1 U3.49(U0TXD) U$3.10
N$74: U3.33(SPICLK) U5.6(SCK)
N$75: U3.30(SPIHD) U5.7(!HOLD!(D3))
N$76: U3.31(SPIWP) U5.3(!WP!(D2))
N$77: U3.32(SPICS0) U5.1(!CS!)
N$78: U3.34(SPIQ) U5.2(SO(D1))
N$79: U3.35(SPID) U5.5(SI(D0))
N$80: R18.2 U1.B5(CC2)
OLED_CS: R12.1 U3.19(GPIO14) U$2.6(CS)
OLED_RESET: R17.2 U3.18(GPIO13) U$2.7(RES)
RESET: C4.1 R2.2 R19.2 SW3.P$2 SW3.P$3 U3.4(CHIP_PU)
ROW0: D2.C D3.C D4.C D5.C U3.51(GPIO45)
ROW1: D6.C D7.C D8.C D9.C U3.45(MTDO)
ROW2: D10.C D11.C D12.C D13.C U3.42(GPIO37)
ROW3: D14.C D15.C D16.C D17.C U3.41(GPIO36)
ROW4: D18.C D19.C D20.C D21.C U3.40(GPIO35)
SCLK: U3.16(GPIO11) U$2.9(D0)
SD_CLK: SD1.5(CLK(SCLK)) U3.13(GPIO8)
SD_CMD: SD1.3(CMD(DI)) U3.14(GPIO9)
SD_D0: SD1.7(DAT0(DO)) U3.12(GPIO7)
USB_DN: U2.A7(DN1) U2.B7(DN2) U3.25(GPIO19)
USB_DP: U2.A6(DP1) U2.B6(DP2) U3.26(GPIO20)
Unconnected: JP2.3 LED_R5C1.DOUT(DO) R3.2 SD1.1(DAT2) SD1.8(DAT1) SW21.GND1(G) SW21.GND2(G) SW22.GND1(G) SW22.GND2(G) U1.A8(SBU1) U1.B8(SBU2) U2.A8(SBU1) U2.B8(SBU2) U3.28(SPICS1)

## Notes on the sheet
- 40MHz!!!

## Power pins joined to a net without a drawn wire
VDD_SPI: U3.29(VDD_SPI)

## Library data of the parts
C1-C26 C28-C46 = clock:CAP: Capacitor Standard 0603 ceramic capacitor, and 0.1" leaded capacitor.
C27 = clock:C-US: CAPACITOR, American symbol
D1-D21 = duckypad:ADAFRUIT_CHANGED_DIODE: Diode SMADIODE - SMA Surface Mount Package 20V 1A Schottky Diode Digikey: 641-1014-6-ND DO-1N4148 - Through Hole Small Current Diode SOD-123 20V 1 A (.5mV Vf) Schottky Diode - Digikey: MBRX120TPMSCT-ND SOD-323 10V 570mA (.38mV Vf, 3ns) Schottky Diode - Digikey: ZLLS410CT-ND SOD-523 30V 30mA Schottky Diode (RB751S-40TE61) - Digikey: RB751S-40TE61CT-ND SOT23-R/W - SOT23 Package (R = Solder Paste/Reflow Ovens, W = Hand-Soldering) BAT54Film 40V 300mA - Digikey: 497-7162-1-ND
IC2 = clock:REG1117: 800mA and 1A Low Dropout (LDO) Positive Regulator 1.8V, 2.5V, 2.85V, 3.3V, 5V, and Adj; MPN: REG1117; OC_FARNELL: 1097566; OC_NEWARK: 14P6981
JP2 = adafruit_changed:PINHD-1X3: PIN HEADER
JP3 = adafruit_changed:PINHD-1X1: Pin header 1x1 for 0.1" spacing With round pins
L2 = Discrete:L*
LED_R1C1-LED_R1C4 LED_R2C1-LED_R2C4 LED_R3C1-LED_R3C4 LED_R4C1-LED_R4C4 LED_R5C1-LED_R5C4 = duckypad:WS2812B
R1 R2 R4 R6-R19 = joyAnalog:RESISTOR: Resistor Basic schematic elements and footprints for 0603, 1206, and PTH resistors.
R3 = adafruit_changed:R-US_: RESISTOR, American symbol
R5 = clock:RESISTOR: Resistor Basic schematic elements and footprints for 0603, 1206, and PTH resistors.
SD1 = clock:TF-HOLDER: TF / Micro SD socket is PUSH-PUSH type, the card can be pushed into and auto locked and pushed out by simply press the card. Surface Mounting type.
SW1 SW2 = adafruit_changed:SPST_TACT: SMT 6mm switch, EVQQ2 series http://www.ladyada.net/library/eagle
SW3 SW4 = 3pos_slide_switch:324_SW
SW21 SW22 = switch-alps:EC12E_SW: ALPS rotary Encoder EC12E series with switch; MPN: EC12E2424407; OC_FARNELL: 1520813; OC_NEWARK: 74M1068
SWR1C1-SWR1C4 SWR2C1-SWR2C4 SWR3C1-SWR3C4 SWR4C1-SWR4C4 SWR5C1-SWR5C4 = lul:KAILH_SWITCH_SOCKET_KAILH_SWITCH_SOCKET
U1 U2 = my_usbc_16p:USBC_16P
U3 = ESP32-S3FN8:ESP32-S3FN8: Check availability <https://pricing.snapeda.com/parts/ESP32-S3FN8/Espressif%20Systems/view-part?ref=eda> Check availability <https://pricing.snapeda.com/parts/ESP32-S3FN8/Espressif%20Systems/view-part?ref=eda> Check availability <https://pricing.snapeda.com/parts/ESP32-S3FN8/Espressif%20Systems/view-part?ref=eda>; AVAILABILITY: In Stock; CHECK_PRICES: https://www.snapeda.com/parts/ESP32-S3FN8/Espressif+Systems/view-part/?ref=eda; DESCRIPTION: Espressif Systems [ENGINEERING SAMPLES]SMD IC , Dual-Core MCU, Wi-Fi 2.4G & BLE 5.0 combo, 8 MB Octal SPI PSRAM, QFN 56-pin, 7*7 mm; MF: Espressif Systems; MP: ESP32-S3FN8; PACKAGE: None; PRICE: None; SNAPEDA_LINK: https://www.snapeda.com/parts/ESP32-S3FN8/Espressif+Systems/view-part/?ref=snap
U5 = SparkFun-DigitalIC:W25Q32FV: Winbond W25Q32FV 32Mbit (4MB) Flash The W25Q32FV support the standard Serial Peripheral Interface (SPI), Dual/Quad I/O SPI as well as 2-clocks instruction cycle Quad Peripheral Interface (QPI). Datasheet <http://www.winbond.com/resource-files/w25q32fv%20revh%20091613.pdf>; PROD_ID: IC-13229
U$2 = oled:OLED128
U$3 = duckypad:SH10P
U$7-U$17 U$20-U$22 = duckypad:M2_SCREW_DEV
U$19 = SparkFun-Retired:V_REG_TPS61040
X1 X2 = adafruit_changed:ANTENNA_U.FL: U.FL Antenna Connector
Y1 = SparkFun-Clocks:CRYSTAL-26MHZ: 26MHz Crystal w/ Ground Pin Digikey Example <http://www.digikey.com/product-detail/en/epson/TSX-3225%2026.0000MF09Z-AC3/SER3627CT-ND/1802878> Frequency: 26MHz Frequency Stability: ±9ppm Frequency Tolerance: ±10ppm Load Capacitance: 9pF SparkFun Products: SparkFun ESP32 Thing <https://www.sparkfun.com/products/13907> SparkFun ESP8266 Thing Dev Board <https://www.sparkfun.com/products/13711>; PROD_ID: XTAL-12454

## Board
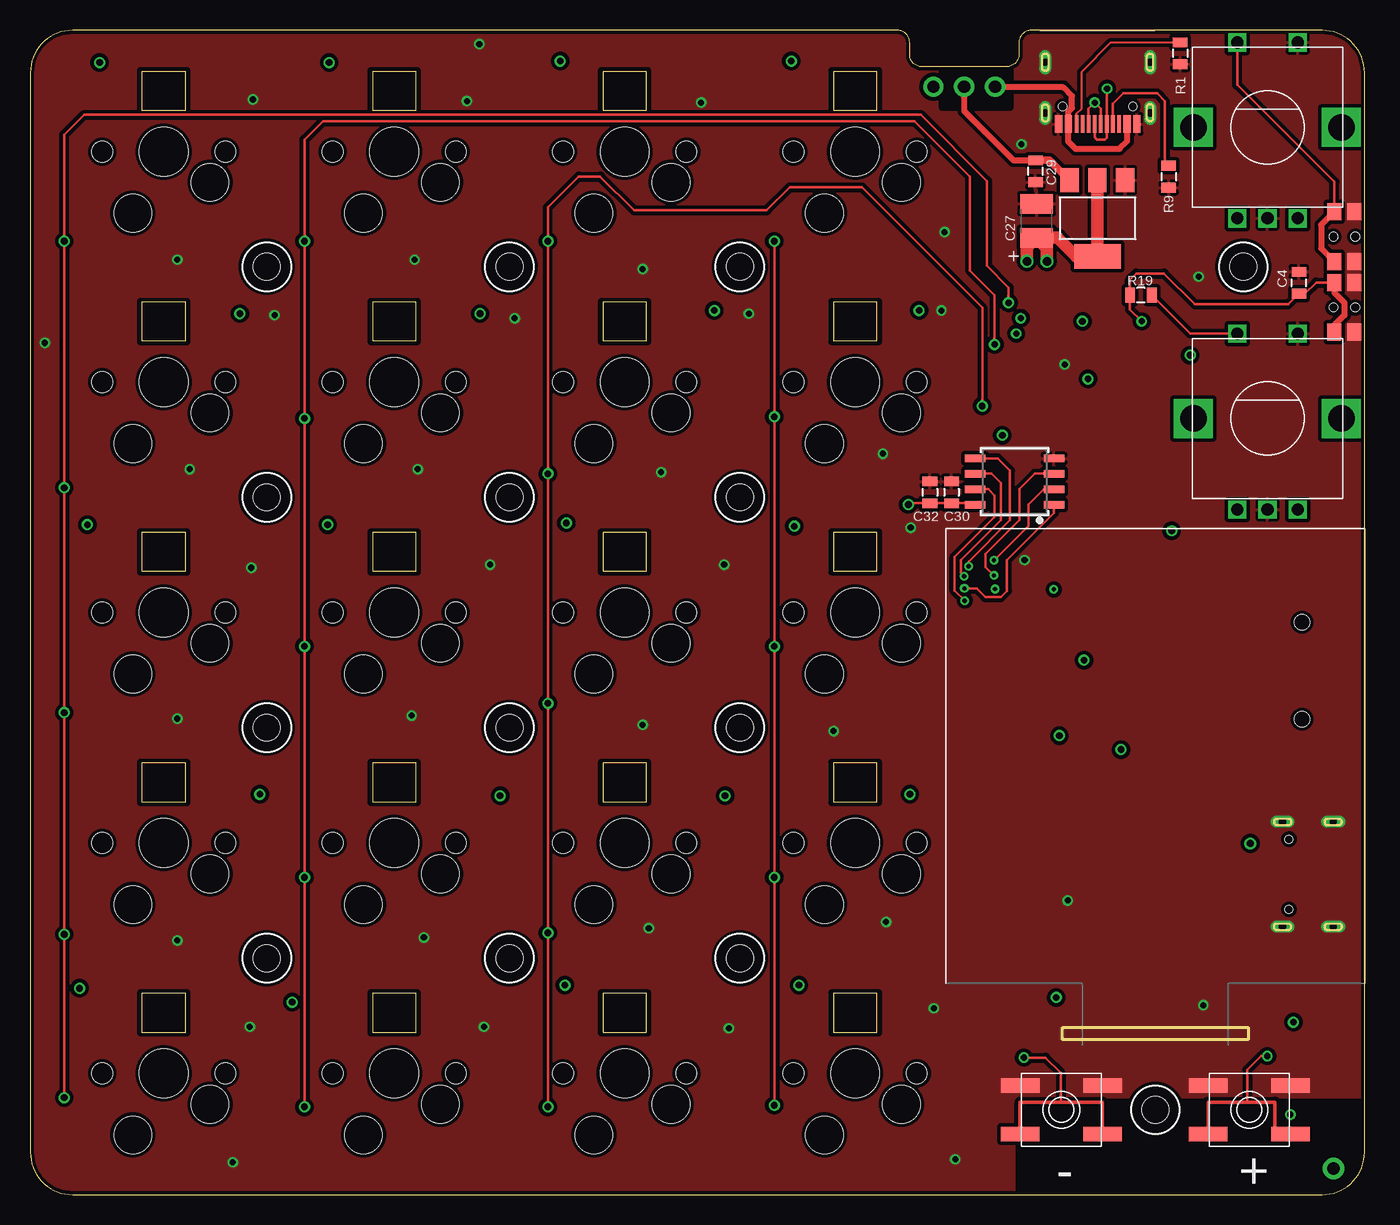
[diagram p5: board, top side]
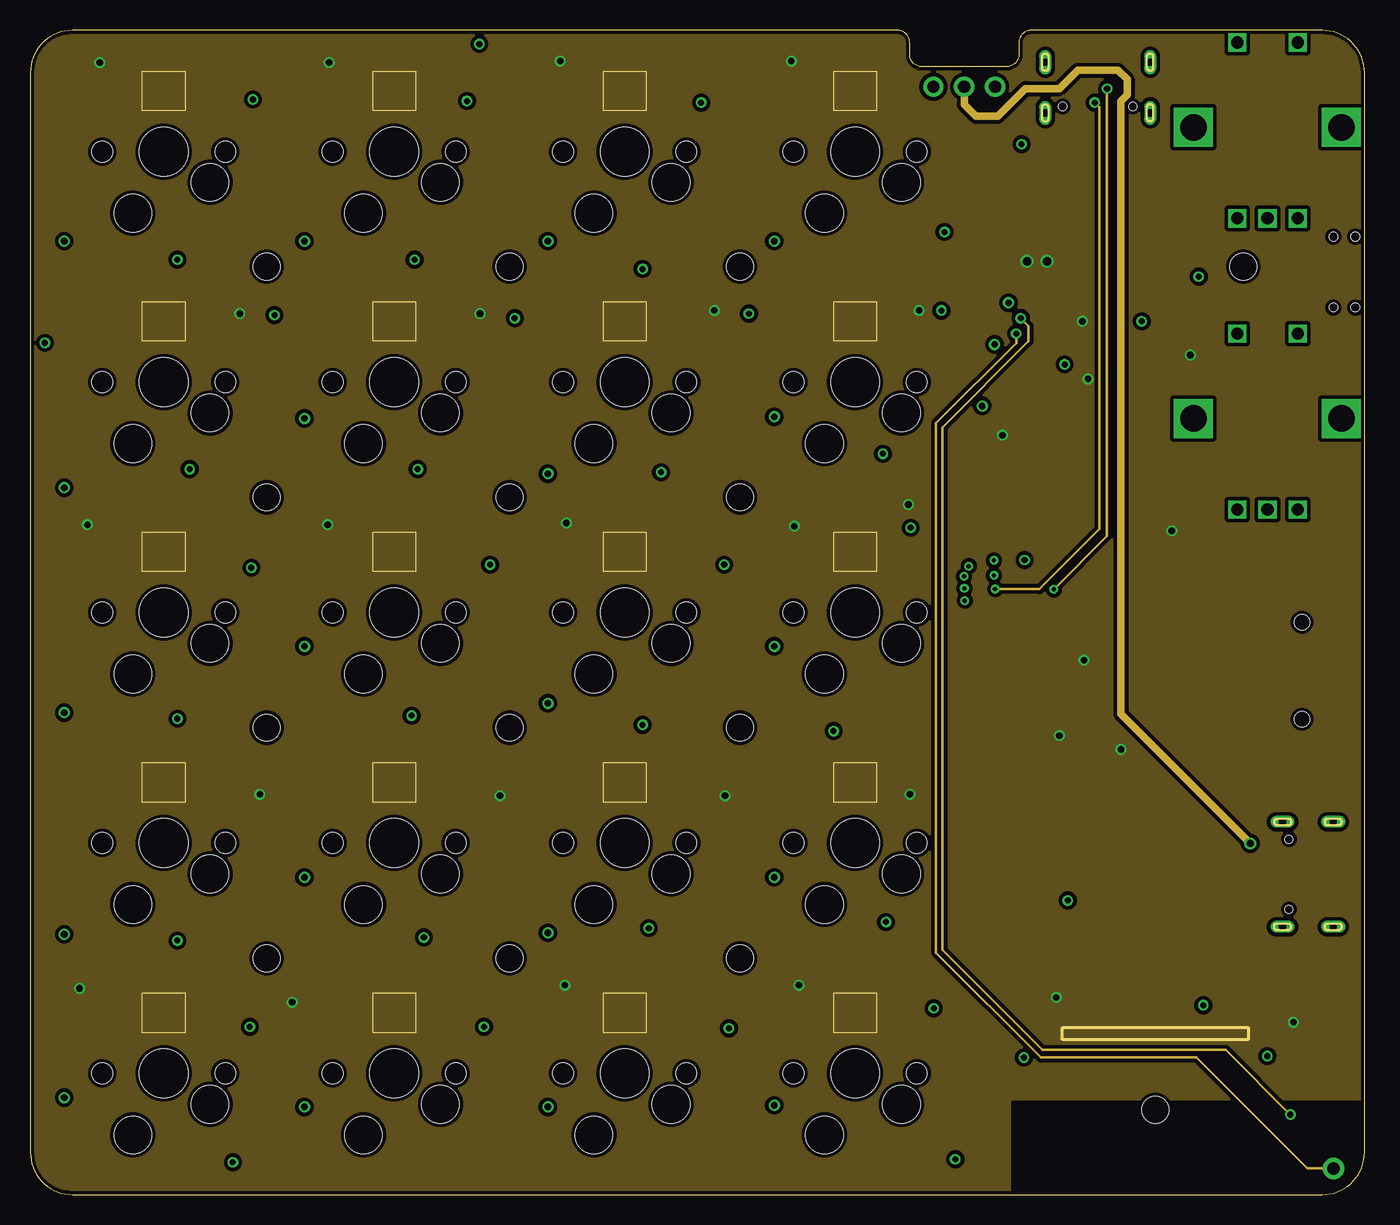
[diagram p6: board, inner layer pwr]
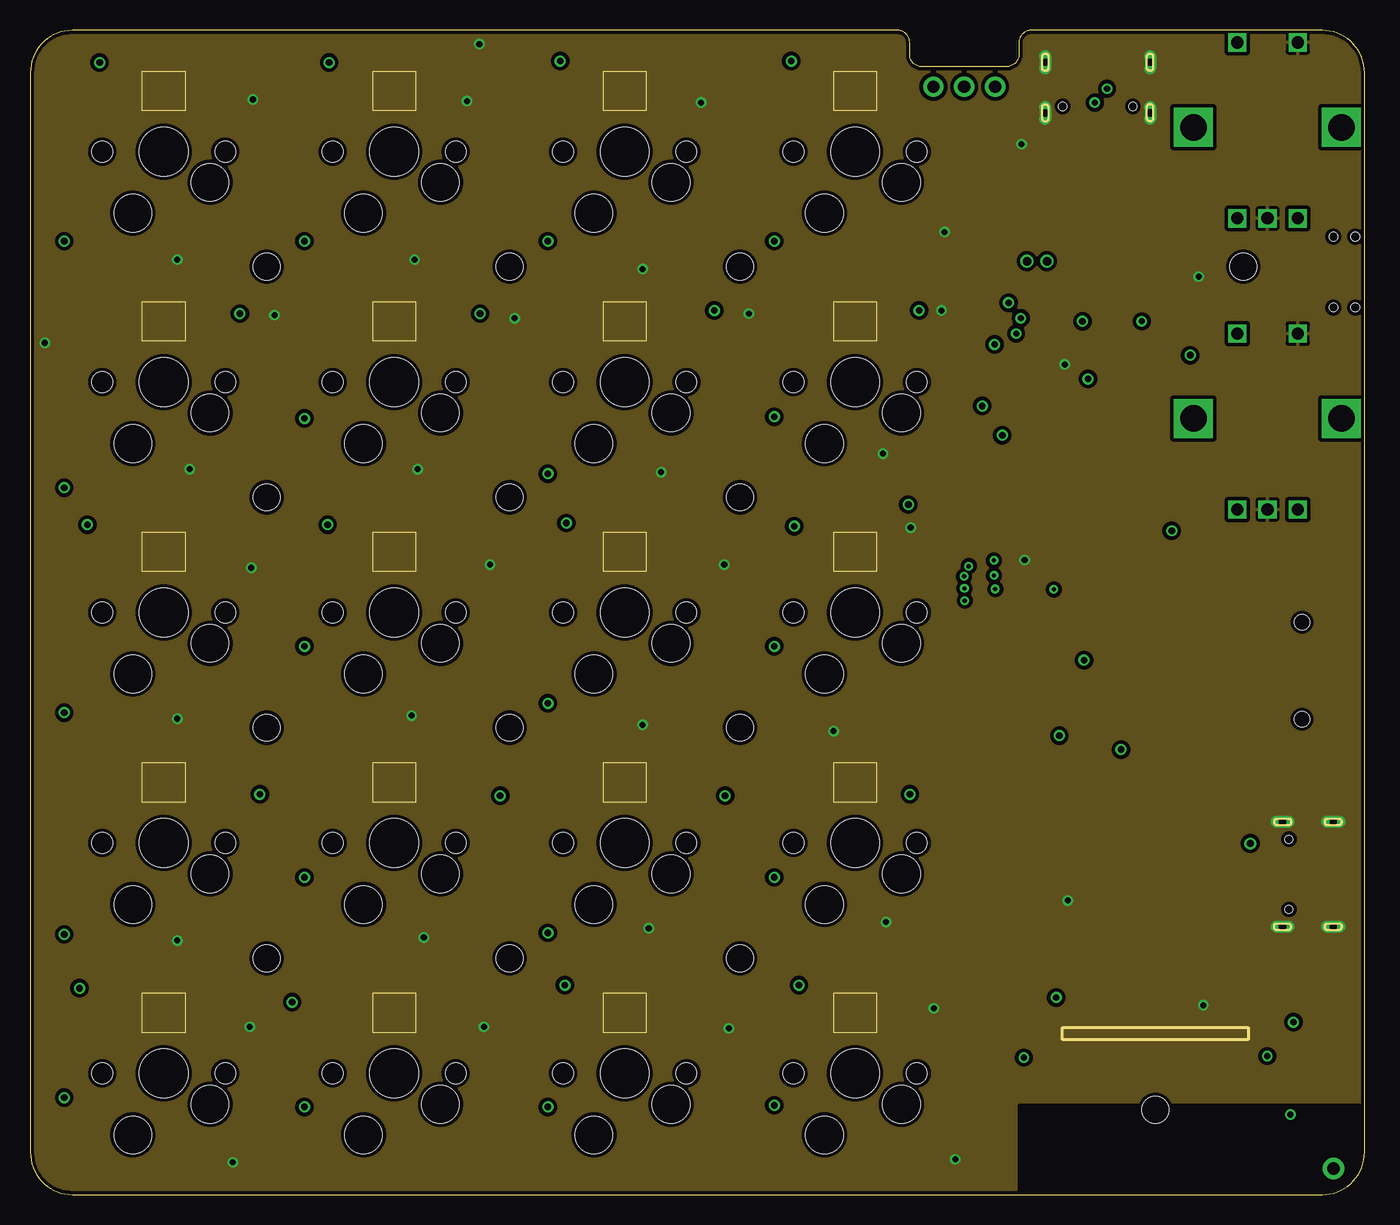
[diagram p7: board, inner layer gnd]
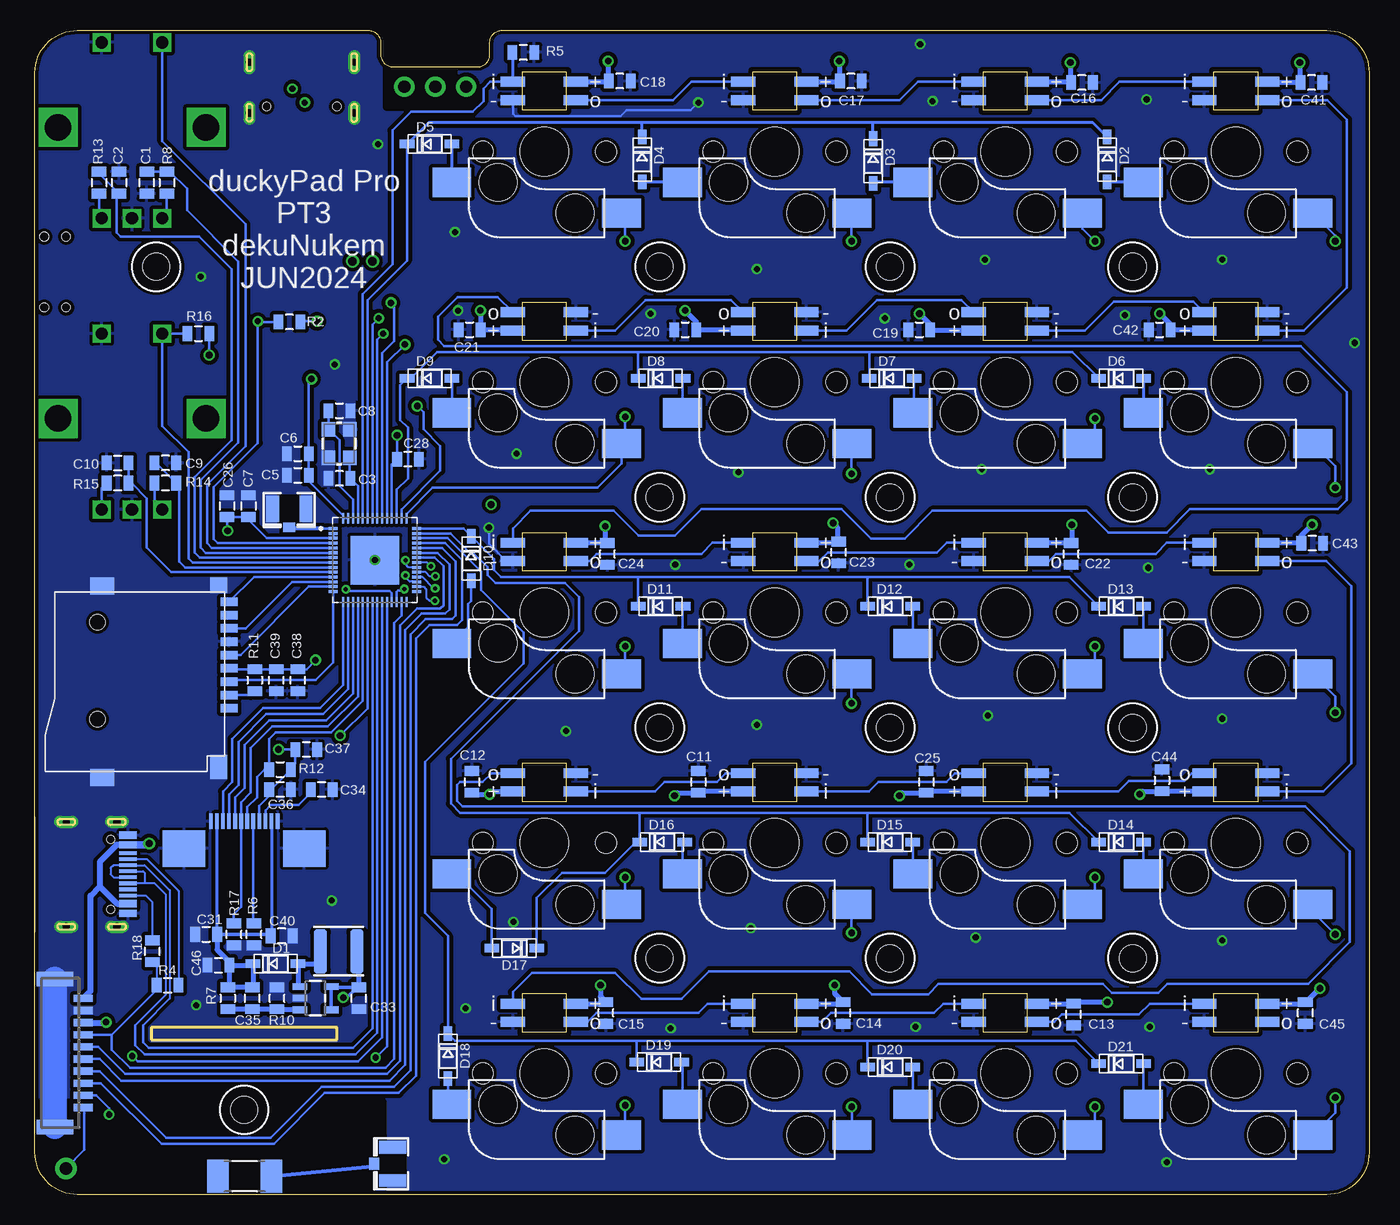
[diagram p8: board, bottom side, seen from below]

Size 110 x 96 mm. Coordinates in mm from the lower left corner, seen from the top.
Outline: 3.5,0 106.5,0 arc90 110,3.5 110,92.5 arc90 106.5,96 82.5,96 arc90 81.5,95 81.5,94 arc-90 80.5,93 73.5,93 arc-90 72.5,94 72.5,95 arc90 71.5,96 3.5,96 arc90 0,92.5 0,3.5 arc90 3.5,0
Copper layers (1+2*15+16): Top 0.035559375mm / dielectric 0.47751875mm / pwr 0.035559375mm / dielectric 0.47751875mm / gnd 0.035559375mm / dielectric 0.47751875mm / Bottom 0.035559375mm
Design rules "SparkFun-4-Layer-General-JLCPCB *": minimum track width 6mil, minimum drill 12mil, track to track 6mil, track to pad 6mil, pad to pad 6mil, via to via 6mil, smd to smd 6mil, copper to edge 6mil, drill to drill 6mil, minimum pad ring 7mil, minimum via ring 7mil, stop-mask expansion 3mil, vias tented up to drill 25mil, thermal gap 10mil
tRestrict: area 81.5,-2.3 to 113.8,7.6; area 75.2,89.7 to 80.8,93
bRestrict: area 81.3,-2.3 to 113.5,7.6; area 75.4,89.7 to 81,93

### Footprints (pad centres in the part's own frame; a part is rotated, then mirrored left to right if it is on the bottom)
0805 = smd 0.8 x 1.2: 1 -0.9,0; 2 0.9,0
C1210 = smd 1.6 x 2.7: 1 -1.4,0; 2 1.4,0
ADAFRUIT_CHANGED_SOD-123 = smd 1.2 x 0.7: A 1.85,0; C -1.85,0
SOT223 = smd 1.499 x 2.007: 1 -2.261,-3.15; 2 0.025,-3.15; 3 2.311,-3.15 | smd 3.81 x 2.007: 4 0,3.15
1X03-CLEANBIG = drill 1.016 pad 1.676: 1 -2.54,0; 2 0,0; 3 2.54,0
1X01-CLEANBIG = drill 1.016 pad 1.778: 1 0,0
L4030 = smd 1.1 x 3.7: 1 -1.5,0; 2 1.5,0
REVERSE_MNT = smd 2 x 0.82 bottom: DIN -2.6,-0.75; DOUT 2.6,0.75; GND -2.6,0.75; VDD 2.6,-0.75
R2010 = smd 1.8 x 2.7: 1 -2.2,0; 2 2.2,0
TF-PULL = smd 0.7 x 1.4: 1 -2.2,-7.62; 2 -1.1,-7.62; 3 0,-7.62; 4 1.1,-7.62; 5 2.2,-7.62; 6 3.3,-7.62; 7 4.4,-7.62; 8 5.5,-7.62; 9 6.6,-7.62 | smd 1.4 x 2: S1 -7.9,2.85; S2 7.9,2.85 | smd 1.28 x 1.4: S3 7.96,-6.75 | smd 1.95 x 1.4: S4 -7.025,-6.75 | hole 1.25: -3.1,3.25; 4.9,3.25
EVQ-Q2 = smd 3.2 x 1.2: A -3.4,-2; A' 3.4,-2; B -3.4,2; B' 3.4,2
342_SWICH_FOOT_HOLE = smd 1.4 x 1.15: P$1 -2.05,-0.825; P$2 -2.05,0.825; P$3 2.05,0.825; P$4 2.05,-0.825 | hole 0.7: 0,0.9; 0,-0.9
ALPS_EC12E_SW = drill 1 square: A -2.5,-7.5; B 2.5,-7.5; C 0,-7.5; D -2.5,7; E 2.5,7 | drill 2.2 square: GND1 -6.1,0; GND2 6.1,0
KAILH_SWITCH_SOCKET_SWITCH_SOCKET = smd 3.2 x 2.4 bottom: 1 6.355,5.08; 2 -7.625,2.54 | hole 4: 0,0 | hole 3.1: -3.81,2.54; 2.54,5.08 | hole 1.7: -5.08,0; 5.08,0
USBC_16P_FOOT = smd 0.6 x 1.45: A1B12 -3.225,3.848; A4B9 -2.425,3.848; B4A9 2.425,3.848; B11A12 3.225,3.848 | smd 0.3 x 1.45: A5 -1.25,3.848; A6 -0.25,3.848; A7 0.25,3.848; A8 1.25,3.848; B5 1.75,3.848; B6 0.75,3.848; B7 -0.75,3.848; B8 -1.75,3.848 | drill 0.6 pad 1 long: P$13 -4.32,2.933; P$14 4.32,2.933; P$15 -4.32,-1.248; P$16 4.32,-1.248 | hole 0.65: -2.89,2.402; 2.89,2.402
QFN40P700X700X90-57N = smd 0.81 x 0.22: 1 -3.445,2.6; 2 -3.445,2.2; 3 -3.445,1.8; 4 -3.445,1.4; 5 -3.445,1; 6 -3.445,0.6; 7 -3.445,0.2; 8 -3.445,-0.2; 9 -3.445,-0.6; 10 -3.445,-1; 11 -3.445,-1.4; 12 -3.445,-1.8; 13 -3.445,-2.2; 14 -3.445,-2.6; 29 3.445,-2.6; 30 3.445,-2.2; 31 3.445,-1.8; 32 3.445,-1.4; 33 3.445,-1; 34 3.445,-0.6; 35 3.445,-0.2; 36 3.445,0.2; 37 3.445,0.6; 38 3.445,1; 39 3.445,1.4; 40 3.445,1.8; 41 3.445,2.2; 42 3.445,2.6 | smd 0.22 x 0.81: 15 -2.6,-3.445; 16 -2.2,-3.445; 17 -1.8,-3.445; 18 -1.4,-3.445; 19 -1,-3.445; 20 -0.6,-3.445; 21 -0.2,-3.445; 22 0.2,-3.445; 23 0.6,-3.445; 24 1,-3.445; 25 1.4,-3.445; 26 1.8,-3.445; 27 2.2,-3.445; 28 2.6,-3.445; 43 2.6,3.445; 44 2.2,3.445; 45 1.8,3.445; 46 1.4,3.445; 47 1,3.445; 48 0.6,3.445; 49 0.2,3.445; 50 -0.2,3.445; 51 -0.6,3.445; 52 -1,3.445; 53 -1.4,3.445; 54 -1.8,3.445; 55 -2.2,3.445; 56 -2.6,3.445 | smd 4 x 4: 57 0,0
SOIC-8 = smd 0.61 x 1.702: 1 -1.905,-3.251; 2 -0.635,-3.251; 3 0.635,-3.251; 4 1.905,-3.251; 5 1.905,3.251; 6 0.635,3.251; 7 -0.635,3.251; 8 -1.905,3.251
LUL_UG-2864HSWEG01_1.3_WRAPAROUND = smd 0.31 x 1.28 bottom: 1 -2.75,-0.22; 2 -2.25,-0.22; 3 -1.75,-0.22; 4 -1.25,-0.22; 5 -0.75,-0.22; 6 -0.25,-0.22; 7 0.25,-0.22; 8 0.75,-0.22; 9 1.25,-0.22; 10 1.75,-0.22; 11 2.25,-0.22; 12 2.75,-0.22 | smd 3.5 x 3 bottom: 31 -4.95,-2.46; 32 4.95,-2.46
DUCKYPAD_SM12B-SSR-H-TB = smd 0.6 x 1.55: 1 -4.5,1.925; 2 -3.5,1.925; 3 -2.5,1.925; 4 -1.5,1.925; 5 -0.5,1.925; 6 0.5,1.925; 7 1.5,1.925; 8 2.5,1.925; 9 3.5,1.925; 10 4.5,1.925 | smd 1.2 x 3: FIT@1 -6.1,-0.4; FIT@2 6.1,-0.4
M2_SCREW_FOOT = hole 2.2: 0,0
SOT23-5 = smd 0.55 x 1.2: 1 -0.95,-1.3; 2 0,-1.3; 3 0.95,-1.3; 4 0.95,1.3; 5 -0.95,1.3
U.FL = smd 2.2 x 1.05: 1 0,1.375; 2 0,-1.375 | smd 0.8 x 1: 3 1.525,0
CRYSTAL-SMD-3.2X2.5MM = smd 1.2 x 1.1: 1 -1.175,-0.875; 2 1.175,-0.875; 3 1.175,0.875; 4 -1.175,0.875

### Placement (x,y rotation side)
C1  100.77,83.44 90 bottom
C2  103.06,83.44 270 bottom
C3  84.9,59.05 180 bottom
C4  104.58,75.18 90 top
C5  88.33,59.31 0 bottom
C6  88.33,61.09 0 bottom
C7  92.39,56.77 270 bottom
C8  84.9,64.64 0 bottom
C9  99.25,60.33 180 bottom
C10  103.19,60.33 0 bottom
C11  55.31,34.04 270 bottom
C12  73.97,34.04 270 bottom
C13  24.38,14.86 90 bottom
C14  43.37,14.99 90 bottom
C15  62.93,14.99 90 bottom
C16  23.68,91.69 180 bottom
C17  42.73,91.82 180 bottom
C18  61.78,91.82 180 bottom
C19  37.08,71.31 0 bottom
C20  56.39,71.31 0 bottom
C21  74.17,71.31 0 bottom
C22  24.57,52.83 90 bottom
C23  43.75,52.96 90 bottom
C24  62.8,52.83 90 bottom
C25  36.51,34.04 270 bottom
C26  94.17,56.77 270 bottom
C27  82.97,80.3 90 top
C28  79.25,60.64 180 bottom
C29  82.87,84.38 90 top
C30  75.95,57.91 270 top
C31  95.89,21.46 0 bottom
C32  74.17,57.91 270 top
C33  83.31,16.2 90 bottom
C34  86.36,33.4 180 bottom
C35  92.08,16.2 90 bottom
C36  89.79,33.4 180 bottom
C37  87.63,36.7 180 bottom
C38  88.33,42.42 90 bottom
C39  90.1,42.42 90 bottom
C40  89.66,21.34 180 bottom
C41  4.76,91.69 180 bottom
C42  17.27,71.31 0 bottom
C43  4.7,53.72 180 bottom
C44  17.08,34.16 270 bottom
C45  5.27,14.99 90 bottom
C46  94.87,18.92 0 bottom
D1  90.17,19.05 0 bottom
D2  21.59,85.34 270 bottom
D3  40.89,85.22 270 bottom
D4  59.94,85.34 270 bottom
D5  77.47,86.61 0 bottom
D6  20.45,67.31 0 bottom
D7  39.37,67.31 0 bottom
D8  58.42,67.31 0 bottom
D9  77.47,67.31 0 bottom
D10  74.04,52.45 270 bottom
D11  58.42,48.51 0 bottom
D12  39.5,48.51 0 bottom
D13  20.45,48.51 0 bottom
D14  20.45,29.08 0 bottom
D15  39.5,29.08 0 bottom
D16  58.29,29.08 0 bottom
D17  70.48,20.32 180 bottom
D18  75.95,11.43 270 bottom
D19  58.55,10.92 0 bottom
D20  39.5,10.54 0 bottom
D21  20.45,10.79 0 bottom
IC2  88,80.5 180 top
JP2  77,91.35 0 bottom
JP3  107.44,2.16 0 top
L2  84.96,20.07 180 bottom
LED_R1C1  11,91 180 top
LED_R1C2  30,91 180 top
LED_R1C3  49,91 180 top
LED_R1C4  68,91 180 top
LED_R2C1  11,72 0 top
LED_R2C2  30,72 0 top
LED_R2C3  49,72 0 top
LED_R2C4  68,72 0 top
LED_R3C1  11,53 180 top
LED_R3C2  30,53 180 top
LED_R3C3  49,53 180 top
LED_R3C4  68,53 180 top
LED_R4C1  11,34 0 top
LED_R4C2  30,34 0 top
LED_R4C3  49,34 0 top
LED_R4C4  68,34 0 top
LED_R5C1  11,15 180 top
LED_R5C2  30,15 180 top
LED_R5C3  49,15 180 top
LED_R5C4  68,15 180 top
R1  94.8,94.11 270 top
R2  89.03,71.95 180 bottom
R3  92.71,1.52 180 bottom
R4  99.06,17.27 0 bottom
R5  69.73,94.17 180 bottom
R6  91.95,21.46 90 bottom
R7  94.11,16.2 270 bottom
R8  99.12,83.44 270 bottom
R9  93.85,83.93 270 top
R10  90.04,16.2 90 bottom
R11  91.88,42.42 270 bottom
R12  89.79,35.05 0 bottom
R13  104.71,83.44 270 bottom
R14  99.25,58.67 180 bottom
R15  103.19,58.67 180 bottom
R16  96.52,70.99 0 bottom
R17  93.6,21.46 90 bottom
R18  100.33,20.07 90 bottom
R19  91.57,74.17 180 top
SD1  101.6,42.29 90 bottom
SW1  100.5,7 180 top
SW2  85,7 180 top
SW3  108.33,73.15 90 top
SW4  108.33,78.99 90 top
SW21  102,64 0 top
SW22  102,88 0 top
SWR1C1  11,86 180 top
SWR1C2  30,86 180 top
SWR1C3  49,86 180 top
SWR1C4  68,86 180 top
SWR2C1  11,67 180 top
SWR2C2  30,67 180 top
SWR2C3  49,67 180 top
SWR2C4  68,67 180 top
SWR3C1  11,48 180 top
SWR3C2  30,48 180 top
SWR3C3  49,48 180 top
SWR3C4  68,48 180 top
SWR4C1  11,29 180 top
SWR4C2  30,29 180 top
SWR4C3  49,29 180 top
SWR4C4  68,29 180 top
SWR5C1  11,10 180 top
SWR5C2  30,10 180 top
SWR5C3  49,10 180 top
SWR5C4  68,10 180 top
U1  106.17,26.42 270 bottom
U2  88,92.13 180 top
U3  81.98,52.32 0 bottom
U5  81.15,58.8 90 top
U$2  92.75,31 0 top
U$3  107.95,11.68 270 bottom
U$7  39.5,19.5 0 top
U$8  39.5,57.5 0 top
U$9  58.5,76.5 0 top
U$10  92.75,7 0 top
U$11  39.5,76.5 0 top
U$12  39.5,38.5 0 top
U$13  58.5,19.5 0 top
U$14  19.5,76.5 0 top
U$15  58.5,57.5 0 top
U$16  58.5,38.5 0 top
U$17  100,76.5 0 top
U$19  86.87,16.2 270 bottom
U$20  19.5,38.5 0 top
U$21  19.5,57.5 0 top
U$22  19.5,19.5 0 top
X1  89.03,56.56 270 bottom
X2  80.52,2.54 180 bottom
Y1  84.92,61.93 270 bottom

### Tracks (layer width: path | path; a pad name or v marks a point on that pad's centre or on a via)
12V
  Bottom 0.254: U$2.11 95,21.48 C31.2 | U$2.2 90.5,21.4 C40.2
  Bottom 0.305: C31.2 90.69,21.46 C40.2
  Bottom 0.406: C46.2 93.97,17.23 R7.1 C35.2 92.02,17.15 D1.C 92.15,18.92 C46.2 | C31.2 94.98,20.19 93.97,19.18 C46.2
+3V3  (via drill 0.55, 0.7)
  Top 0.203: v72.39,56.9 72.51,57.01 C32.2 C30.2 77.79,57.01 U5.8
  Top 1.016: C27.1 84.68,78.9 86.23,77.35 IC2.4 87.97,77.38 IC2.2 | v82.17,76.96 82.17,78.09 C27.1 | v83.82,76.96 83.82,78.05 C27.1
  Bottom 0.203: v80.14,62.61 v80.15,62.6 C28.2 80.58,60.21 U3.46 | v86.87,44.07 87.62,43.32 C38.2 C39.2 R11.1 93.91,43.32 SD1.4 | U$2.4 91.51,30.79 91.51,32.06 90.69,32.88 C36.2 90.54,33.4 R12.2 89.03,35.05 88.53,35.55 C37.2 v89.92,36.7 | U3.20 82.58,40.11 v84.84,37.85 | U3.55 U3.56 84.58,56 87.43,58.85 C5.2 C6.2 87.43,67.03 v87.2,67.26 | U3.2 U3.3 90.9,54.12 92.39,55.62 C7.2 C26.2 94.17,54.8 v94.11,54.74 | R16.2 v95.63,69.22 | v86.74,72.01 88.07,72.01 R2.1
  Bottom 0.305: U$19.4 U$19.5 85.52,17.09 C33.2 83.41,17.09 84.25,16.26 v84.58,16.26
  Bottom 0.406: LED_R1C4.VDD 62.75,91.75 C18.2 62.74,91.88 v62.74,93.47 | LED_R1C1.VDD 8.34,91.69 C41.2 5.71,91.75 v5.71,93.34 | LED_R1C2.VDD 24.64,91.75 | 24.64,91.75 C16.2 | LED_R1C3.VDD 43.7,91.75 C17.2 43.69,91.88 v43.69,93.47 | LED_R3C4.VDD 65.38,53.73 C24.2 62.99,53.92 v62.99,55.12 | LED_R3C1.VDD 8.37,53.72 C43.2 5.6,54.34 v4.7,55.24 | LED_R3C3.VDD 43.86,53.75 | 43.86,53.75 C23.2 | LED_R3C2.VDD 24.59,53.75 | 24.59,53.75 C22.2 | LED_R4C3.VDD 55.19,33.25 C11.2 57.03,33.14 v57.28,32.89 | LED_R4C2.VDD 36.4,33.25 C25.2 38.49,33.14 v38.73,32.89 | LED_R5C2.VDD 24.39,15.75 C13.2 24.27,15.88 v21.59,15.88 | LED_R5C3.VDD 43.5,15.75 C14.2 44.07,16.59 v44.07,17.27 | LED_R5C4.VDD 63.06,15.75 C15.2 63.37,16.33 v63.37,17.27 | LED_R4C1.VDD 17.07,33.25 C44.2 18.68,33.26 v18.92,33.02 | LED_R5C1.VDD 5.4,15.75 C45.2 5.2,15.89 v4.06,17.02 | L2.1 83.31,19.91 C33.2 | C12.2 73.86,33.02 v72.52,33.02 72.29,33.25 LED_R4C4.VDD | v24.64,93.34 24.64,91.75 | v17.27,72.64 16.37,71.74 C42.2 13.66,71.31 LED_R2C1.VDD | v37.08,72.64 36.18,71.74 C19.2 36.13,71.25 LED_R2C2.VDD | v56.39,72.9 55.49,72 C20.2 51.66,71.31 LED_R2C3.VDD | v73.28,72.9 C21.2 70.66,71.31 LED_R2C4.VDD | v44.2,55.37 43.86,55.03 43.86,53.75 | v24.51,55.24 24.51,53.83 24.59,53.75
  Bottom 0.508: U$3.3 104.18,14.18 v104.14,14.22
  pour pwr (isolate 0.305): -6.48,107.7 127.13,107.7 127.13,-13.08 -6.48,-13.08
AUX_DN
  Bottom 0.152: U1.A7 103.51,26.17 103.76,26.42 103.76,26.92 103.52,27.17 U1.B7 100.95,27.17 98.88,25.09 98.88,16.18 101.09,13.97
  Bottom 0.203: 101.09,13.97 101.09,12.57 100.64,12.12 83.77,12.12 82.18,13.71 U3.21
AUX_DP
  Bottom 0.152: U1.A6 101.09,26.67 100.97,26.54 100.97,25.67 | 100.97,25.67 U1.B6 | 101.73,13.97 99.24,16.46 99.24,24.77 100.14,25.67 100.97,25.67
  Bottom 0.203: U3.22 81.78,13.35 83.57,11.56 100.97,11.56 101.73,12.32 101.73,13.97
CARD_DET
  Bottom 0.203: SD1.9 91.95,50.92 U3.11
CC_BUSY
  Bottom 0.152: R18.1 99.96,18.8 R4.1
  Bottom 0.203: U3.27 79.78,47.73 80.38,47.13 80.38,11.19 81.1,10.46 102.16,10.46 103.66,11.96 103.66,13.18 | R4.1 99.96,16.88 103.66,13.18 | 103.66,13.18 U$3.4
COL0  (via drill 0.55)
  Top 0.203: v2.79,8 v2.79,21.46 v2.79,39.75 v2.79,58.29 v2.79,78.61 2.79,87.38 4.45,89.03 73.41,89.03 78.87,83.57 78.87,76.58 80.64,74.8 v80.64,73.53
  Bottom 0.203: SWR1C1.1 2.79,79.07 v2.79,78.61 | SWR2C1.1 2.79,60.07 v2.79,58.29 | SWR3C1.1 2.79,41.07 v2.79,39.75 | SWR5C1.1 2.79,6.77 v2.79,8 | v80.64,73.53 80.39,73.28 80.39,70.36 81.38,69.37 U3.48 | v2.79,21.46 4.64,23.31 SWR4C1.1
COL1  (via drill 0.55)
  Top 0.203: v22.61,7.24 v22.61,26.16 v22.61,45.21 v22.61,64.01 v22.61,78.61 22.61,87 24.13,88.52 72.9,88.52 77.47,83.95 77.47,76.2 79.5,74.17 v79.5,70.1
  Bottom 0.203: SWR1C2.1 23.64,79.65 v22.61,78.61 | SWR2C2.1 22.61,62.96 v22.61,64.01 | SWR3C2.1 22.61,43.96 v22.61,45.21 | SWR4C2.1 22.61,24.96 v22.61,26.16 | SWR5C2.1 22.61,5.96 v22.61,7.24 | v79.5,70.1 80.98,68.63 U3.47
COL2  (via drill 0.55)
  Top 0.203: v42.67,7.24 v42.67,21.59 v42.67,40.51 v42.67,59.44 v42.67,78.61 42.67,81.41 45.21,83.95 46.99,83.95 49.78,81.15 60.71,81.15 62.61,83.06 68.58,83.06 78.49,73.15 v78.49,65.02
  Bottom 0.203: SWR1C3.1 42.67,80.89 v42.67,78.61 | SWR2C3.1 42.67,61.89 v42.67,59.44 | SWR3C3.1 42.67,42.89 v42.67,40.51 | SWR4C3.1 42.67,23.89 v42.67,21.59 | SWR5C3.1 42.65,7.21 v42.67,7.24 | U3.44 79.78,56.49 76.58,59.69 76.58,61.72 77.98,63.12 77.98,64.52 v78.49,65.02
COL3  (via drill 0.55)
  Top 0.203: v61.34,78.61 v61.34,64.14 v61.34,45.21 v61.34,26.16 v61.34,7.37
  Bottom 0.203: SWR5C4.1 61.34,5.22 v61.34,7.37 | SWR4C4.1 61.34,24.22 v61.34,26.16 | SWR3C4.1 61.34,43.22 v61.34,45.21 | v61.34,64.14 61.34,62.22 SWR2C4.1 61.65,60.27 63.63,58.29 77.22,58.29 79.38,56.13 U3.43 | SWR1C4.1 61.34,80.62 v61.34,78.61
DC
  Bottom 0.203: U3.17 83.78,41.32 85.98,39.12 90.68,39.12 92.71,37.08 92.71,33.53 93.5,32.74 U$2.8
GND  (via drill 0.5)
  Bottom 0.203: LED_R3C4.GND 71.15,52.25 72.58,53.68 v72.58,54.99 | LED_R1C4.GND 70.6,89.14 70.36,88.9 61.72,88.9 61.21,89.41 55.94,89.41 v55.31,90.04
  Bottom 2.032: U$3.FIT@2 U$3.FIT@1
  other vias: 96.33,75.69 81.98,52.32 74.48,15.37 81.72,86.61 75.12,72.9 36,90.17 18.35,90.3 20.13,72.52 39.94,72.26 59.24,72.64 37.91,51.94 57.21,51.94 18.22,51.69 37.4,13.84 57.59,13.72 18.09,13.84 70.29,61.09 76.26,2.92 37.02,94.87 12.13,77.09 31.68,77.09 50.48,76.33 75.37,79.38 52,59.56 31.94,59.82 13.14,59.82 1.2,70.23 31.43,39.5 12.13,39.24 50.48,38.73 66.23,38.23 70.55,22.48 50.99,21.97 32.45,21.21 12.13,20.95 16.7,2.67 96.71,15.62 85.53,24.26 85.28,68.45
  pour Top (isolate 0.305): -4,103 -4,-10 123,-10 123,103
  pour Bottom (isolate 0.305): 133,116.13 133,-20.35 -16,-20.35 -16,116.13
  pour Top (isolate 0.305, no thermals): 79.69,9.91 90.36,9.91 90.36,8.13 79.69,8.13
  pour Top (isolate 0.305, no thermals): 95.06,9.91 105.72,9.91 105.72,8.13 95.06,8.13
  pour Bottom (isolate 0.305, no thermals): 83.63,65.91 89.85,65.91 89.85,58.42 83.63,58.42
  pour Bottom (isolate 0.305, no thermals): 86.93,59.05 94.68,59.05 94.68,54.61 86.93,54.61
  pour Bottom (isolate 0.305, no thermals): 78.29,5.21 86.8,5.21 86.8,-0.76 78.29,-0.76
  pour gnd (isolate 0.305): -11.81,111.38 130.05,111.38 130.05,-16.89 -11.81,-16.89
  pour Bottom (isolate 0.305, no thermals): 82.61,22.35 97.98,22.35 97.98,13.72 82.61,13.72
MOSI
  Bottom 0.203: U3.15 84.58,42.04 86.49,40.13 91.19,40.13 93.73,37.59 93.73,34.04 94.5,33.26 U$2.10
N$1
  Top 0.508: JP2.1 79.58,91.31 85.16,91.31 85.89,90.58 85.89,89.59 85.58,89.27 U2.B4A9 85.58,86.83 86.17,86.23 89.79,86.23 90.42,86.87 U2.A4B9
N$2
  Bottom 0.203: LED_R1C4.DOUT 57.38,90.25 55.88,91.75 LED_R1C3.DIN
N$3
  Bottom 0.203: LED_R1C2.DIN 37.22,91.75 38.72,90.25 LED_R1C3.DOUT
N$4
  Bottom 0.203: LED_R1C2.DOUT 22.08,90.25 20.58,91.75 LED_R1C1.DIN
N$5
  Bottom 0.203: LED_R1C1.DOUT 3.44,90.25 1.84,88.65 1.84,74.8 5.39,71.25 LED_R2C1.DIN
N$6
  Bottom 0.203: LED_R2C1.DOUT 14.49,73.64 21.04,73.64 23.43,71.25 LED_R2C2.DIN
N$7
  Bottom 0.203: LED_R2C2.DOUT 33.62,73.77 40.59,73.77 43.11,71.25 LED_R2C3.DIN
N$8
  Bottom 0.203: U$2.3 91,31.68 90.55,32.13 88.27,32.13 87.26,33.14 C34.2
N$9
  Bottom 0.203: LED_R2C3.DOUT 52.62,73.77 59.65,73.77 62.16,71.25 LED_R2C4.DIN
N$10
  Bottom 0.203: U$2.5 92,22.41 R6.2
N$11
  Bottom 0.203: LED_R3C4.DIN 70.6,54.94 69.15,56.39 62.29,56.39 60.26,54.36 57.21,54.36 55.05,56.52 43.49,56.52 41.08,54.1 38.29,54.1 36,56.39 23.3,56.39 21.52,54.61 16.7,54.61 14.79,56.52 2.6,56.52 1.84,57.28 1.84,66.17 5.65,69.98 76.26,69.98 76.77,70.48 76.77,72.39 75.14,74.02 71.87,74.02 LED_R2C4.DOUT
N$12
  Bottom 0.203: LED_R3C4.DOUT 64.27,52.25 63.69,52.83 55.05,52.83 54.13,53.75 LED_R3C3.DIN
N$13
  Bottom 0.203: LED_R3C3.DOUT 45.35,52.25 44.64,52.96 35.62,52.96 34.83,53.75 LED_R3C2.DIN
N$14
  Bottom 0.203: U3.9 97.63,51.72 98.11,52.2 98.11,58.43 R14.1 100,60.33 C9.2
N$15
  Bottom 0.203: LED_R3C2.DOUT 26.42,52.25 25.84,52.83 17.59,52.83 16.67,53.75 LED_R3C1.DIN
N$16
  Bottom 0.203: LED_R3C1.DOUT 3.54,52.25 1.46,50.16 1.46,35.56 3.77,33.25 LED_R4C1.DIN
N$17
  Bottom 0.203: LED_R4C2.DIN 20.66,33.25 19.79,34.12 15.25,34.12 14.62,34.75 LED_R4C1.DOUT
N$18
  Bottom 0.203: LED_R4C2.DOUT 34.15,34.75 34.86,34.04 40.45,34.04 41.23,33.25 LED_R4C3.DIN
N$19
  Bottom 0.203: LED_R4C3.DOUT 53.07,34.75 53.78,34.04 58.1,34.04 58.89,33.25 LED_R4C4.DIN
N$20
  Bottom 0.203: LED_R4C4.DOUT 72.37,34.75 73.09,34.04 74.93,34.04 75.18,33.78 75.18,32.45 74.74,32 5.27,32 1.58,28.32 1.58,20.83 5.01,17.4 16.64,17.4 17.4,16.64 21.21,16.64 21.97,17.4 35.49,17.4 36.36,16.54 40.98,16.54 42.86,18.41 54.42,18.41 56.7,16.13 60.01,16.13 62.16,18.29 69.02,18.29 70.6,16.71 LED_R5C4.DIN
N$21
  Bottom 0.203: LED_R5C4.DOUT 64.42,14.25 63.69,14.99 55.31,14.99 54.54,15.75 LED_R5C3.DIN
N$22
  Bottom 0.203: LED_R5C3.DOUT 45.12,14.25 44.38,14.99 35.88,14.99 35.11,15.75 LED_R5C2.DIN
N$23
  Bottom 0.203: LED_R5C2.DOUT 25.94,14.25 25.33,14.86 18.98,14.86 18.09,15.75 LED_R5C1.DIN
N$24
  Bottom 0.203: C8.1 Y1.1 84.9,62.2 84.9,58.42 83.78,57.3 U3.54
N$25
  Bottom 0.203: Y1.3 84.05,59.1 C3.1 83.38,58.43 U3.53
N$26
  Bottom 0.203: U3.1 86.3,54.92
  Bottom 0.343: 86.3,54.92 88.93,54.92 X1.3
N$27
  Bottom 0.254: SWR1C4.2 D5.A
N$28
  Top 0.203: SW4.P$3 107.51,83.5 99.5,91.51 SW22.D
  Top 0.508: SW4.P$3 106.43,79.96 106.43,78.02 SW4.P$2
  Bottom 0.203: SW22.D 99.5,86.87 92.64,80.01 92.64,61.72 95.82,58.55 95.82,53.72 95.42,53.32 U3.5
N$29
  Bottom 0.203: LED_R1C4.DIN 72.46,91.75 73.03,91.19 73.03,90.17 73.91,89.28 78.99,89.28 80.52,87.76 80.52,76.71 82.98,74.25 U3.52
  Bottom 0.254: R5.2 70.63,91.78 LED_R1C4.DIN
N$30  (via drill 0.5)
  Top 0.203: v101.98,11.43 101.47,11.43 100.33,10.29 100.33,7.62
  Top 0.305: SW1.B' 97.1,7.62 100.33,7.62 102.62,7.62 102.62,5 SW1.B
  Bottom 0.203: v101.98,11.43 101.55,11 83.36,11 81.38,12.98 U3.23
N$31
  Top 0.152: U2.B5 86.25,89.11 86.67,89.53 86.67,92.58 89.1,95.01 R1.1
N$32
  Bottom 0.152: U1.A5 100.79,27.67 98.16,25.03 R4.2
N$33
  Top 0.203: U2.A5 89.25,89.95 90.1,90.81 92.9,90.81 93.53,90.17 93.53,85.15 R9.1
N$34
  Bottom 0.203: R8.2 99.12,80.88 SW22.A
N$35
  Bottom 0.203: R13.2 104.71,80.71 SW22.B
N$36
  Bottom 0.406: U$19.1 88.32,17.3 D1.A 86.59,19.05 86.46,19.18 L2.2
N$38
  Bottom 0.203: U3.6 95.91,52.92 96.33,53.34 96.33,58.93 93.23,62.03 93.23,76.91 97.47,81.15 97.47,82.93 98.88,84.34 R8.1 C1.2
N$39
  Bottom 0.406: U$19.3 89.99,15.24 R10.1 C35.1 R7.2
N$40
  Bottom 0.203: U3.7 96.4,52.52 96.83,52.96 96.83,59.18 93.79,62.23 93.79,76.33 96.45,78.99 102.93,78.99 103.26,79.32 103.26,82.34 C2.2 104.71,84.19 R13.1
N$41
  Top 0.203: R19.1 95.64,71 SW21.D
  Bottom 0.203: U3.8 97.02,52.12 97.34,52.45 97.34,61.21 99.5,63.37 SW21.D R16.1
N$42
  Bottom 0.203: R15.2 104.5,58.26 SW21.B
N$43
  Bottom 0.203: R11.2 92.21,41.19 SD1.2
N$44
  Bottom 0.254: SWR1C3.2 59.91,83.46 D4.A
N$45
  Bottom 0.254: SWR1C2.2 40.8,83.46 D3.A
N$46
  Bottom 0.254: SWR1C1.2 21.56,83.46 D2.A
N$47
  Bottom 0.203: SWR2C4.2 D9.A
N$48
  Bottom 0.203: R14.2 100.15,57.15 SW21.A
N$49
  Bottom 0.203: U3.10 98.76,51.32 100.77,53.34 100.77,57.4 102.04,58.67 R15.1 C10.2
N$50
  Bottom 0.203: D8.A 56.62,67.31 SWR2C3.2
N$51
  Bottom 0.203: D7.A 37.52,64.46 SWR2C2.2
N$52
  Bottom 0.254: D6.A 18.62,67.28 SWR2C1.2
N$53
  Bottom 0.203: SWR3C4.2 74.3,46.79 74.3,48.7 74.04,48.95 D10.A
N$54
  Bottom 0.203: SWR3C3.2 56.62,48.51 D11.A
N$55
  Bottom 0.203: SWR3C2.2 37.62,48.51 D12.A
N$56
  Bottom 0.203: SWR3C1.2 18.62,48.51 D13.A
N$57
  Bottom 0.203: D17.A 72.33,23.57 75.23,26.46 SWR4C4.2
N$58
  Bottom 0.203: SWR4C3.2 56.62,29.08 D16.A
N$59
  Bottom 0.203: SWR4C2.2 37.62,29.08 D15.A
N$60
  Bottom 0.203: SWR4C1.2 18.62,29.08 D14.A
N$61
  Bottom 0.203: SWR5C4.2 75.95,7.46 D18.A
N$62
  Bottom 0.203: SWR5C3.2 56.62,10.92 D19.A
N$63
  Bottom 0.203: SWR5C2.2 37.62,10.54 D20.A
N$64
  Bottom 0.203: SWR5C1.2 18.62,10.79 D21.A
N$65  (via drill 0.5)
  Top 0.203: v81.92,11.3 83.69,11.3 84.96,10.03 84.96,7.62
  Top 0.305: SW2.B' 81.6,7.62 84.96,7.62 88.4,7.62 SW2.B
  Bottom 0.203: v81.92,11.3 80.98,12.24 U3.24
N$66  (via drill 0.6)
  Top 0.508: 85.67,83.63 IC2.3 | JP2.2 77,89.34 81.06,85.28 C29.2
  Top 0.61: C29.2 84.02,85.28 85.67,83.63
  pwr 0.61: JP2.2 77,89.88 77.98,88.9 79.76,88.9 82.04,91.19 84.84,91.19 86.36,92.71 89.66,92.71 90.42,91.95 90.42,90.68 89.92,90.17 89.92,39.62 v100.58,28.96
  Bottom 0.508: U1.A4B9 103.26,28.84 104.65,27.46 104.65,25.4 | 104.65,25.4 103.24,23.99 U1.B4A9 | U$3.1 105.41,16.8 105.41,24.64 104.65,25.4
  Bottom 0.61: U1.A4B9 100.7,28.84 v100.58,28.96
N$67
  Bottom 0.203: U3.36 77.03,52.52 76.33,51.82 76.33,48.59 76.61,48.31 78.51,48.31 79.91,46.91 79.91,11.02 80.97,9.96 102.54,9.96 104.77,12.18 U$3.5
N$68
  Bottom 0.203: U3.37 76.8,52.92 75.82,51.94 75.82,48.26 76.17,47.9 78.13,47.9 79.48,46.56 79.48,10.69 80.77,9.4 102.87,9.4 104.66,11.18 U$3.6
N$69
  Bottom 0.203: U3.38 76.44,53.32 75.31,52.2 75.31,47.75 75.62,47.45 77.78,47.45 79.05,46.18 79.05,10.24 80.39,8.89 86.36,8.89 90.55,4.7 99.19,4.7 104.67,10.18 U$3.7
N$70
  Bottom 0.203: U3.39 76.2,53.72 74.8,52.32 74.8,47.37 75.18,46.99 77.47,46.99 78.59,45.87 78.59,9.8 80.01,8.38 86.11,8.38 90.3,4.19 99.57,4.19 104.56,9.18 U$3.8
N$71
  Bottom 0.343: R3.1 82.24,2.34 X2.3
N$72  (via drill 0.5)
  pwr 0.203: v81.66,72.26 82.3,71.63 82.3,70.36 75.18,63.25 75.18,20.19 83.44,11.94 98.55,11.94 v103.89,6.6
  Bottom 0.203: U3.50 82.18,71.75 v81.66,72.26 | U$3.9 104.96,8.18 103.89,7.11 v103.89,6.6
N$73  (via drill 0.5)
  pwr 0.203: v81.28,70.99 81.28,70.23 74.68,63.63 74.68,19.94 83.31,11.31 96.13,11.31 105.28,2.16 JP3.1
  Bottom 0.203: U3.49 81.78,70.5 v81.28,70.99 | JP3.1 105.92,3.68 105.92,7.18 U$3.10
N$74  (via drill 0.35)
  Top 0.203: v76.99,50.98 76.71,51.26 76.71,52.32 80.01,55.63 80.01,58.67 79.25,59.44 U5.6
  Bottom 0.152: v76.99,50.98 77.44,50.98 77.79,51.32 U3.33
N$75  (via drill 0.35)
  Top 0.203: v77.04,48.97 76.2,49.81 76.2,52.58 79.5,55.88 79.5,57.66 78.99,58.17 U5.7
  Bottom 0.152: U3.30 77.96,50.12 77.75,49.91 77.75,49.25 77.47,48.97 v77.04,48.97
N$76  (via drill 0.35)
  Top 0.203: v79.45,51.05 78.74,51.77 78.74,52.83 81.53,55.63 81.53,58.17 82.8,59.44 U5.3
  Bottom 0.152: U3.31 78.55,50.55 79.1,50.55 79.45,50.9 v79.45,51.05
N$77  (via drill 0.35)
  Top 0.203: v77.01,49.99 78.03,49.99 78.74,49.28 80.01,49.28 80.52,49.78 80.52,52.32 84.4,56.21 U5.1
  Bottom 0.152: U3.32 78.05,50.92 77.11,49.99 v77.01,49.99
N$78  (via drill 0.35)
  Top 0.203: v79.45,52.3 82.3,55.14 82.3,56.9 83.57,58.17 U5.2
  Bottom 0.152: U3.34 79.18,51.72 79.45,51.99 v79.45,52.3
N$79  (via drill 0.35)
  Top 0.203: v77.37,51.82 77.37,52.22 80.77,55.63 80.77,59.69 79.76,60.71 U5.5
  Bottom 0.152: v77.37,51.82 77.68,52.12 U3.35
N$80
  Bottom 0.152: U1.B5 100.87,24.67 100.33,24.13 R18.2
OLED_CS
  Bottom 0.203: U3.19 82.98,40.72 85.6,38.1 90.17,38.1 90.69,37.58 R12.1 91.07,35.05 91.69,34.43 91.69,32.77 92.5,31.96 U$2.6
OLED_RESET
  Bottom 0.203: R17.2 93.6,23.12 93,23.72 U$2.7 93,32.35 92.2,33.15 92.2,36.83 90.42,38.61 85.85,38.61 83.38,41.08 U3.18
RESET  (via drill 0.5)
  Top 0.203: SW3.P$3 106.01,75.2 105.09,74.28 C4.1 103.7,73.41 96.01,73.41 93.47,75.95 91.19,75.95 90.67,75.43 R19.2 90.67,72.97 v91.63,72.01
  Top 0.508: SW3.P$3 107.51,74.36 108.33,73.53 108.33,72.52 107.51,71.69 SW3.P$2
  Bottom 0.203: U3.4 94.93,53.72 95.25,54.04 95.25,58.35 91.63,61.98 v91.63,72.01 91.57,71.95 R2.2
ROW0
  Bottom 0.203: D5.C 79.32,77.02 82.58,73.76 U3.51
  Bottom 0.254: D2.C 22.79,88.39 40.89,88.39 | D5.C 77.54,88.39 59.94,88.39 | 40.89,88.39 59.94,88.39 | D3.C 40.89,88.39 | D4.C 59.94,88.39
ROW1
  Bottom 0.203: D6.C 24.46,69.47 41.22,69.47 | 41.22,69.47 60.27,69.47 | 60.27,69.47 76.83,69.47 78.99,67.31 D9.C 79.88,66.75 79.88,63.88 79.25,63.25 79.25,59.05 80.18,58.13 U3.45 | D7.C 41.22,69.47 | D8.C 60.27,69.47
ROW2
  Bottom 0.203: U3.42 74.66,54.92 D10.C 72.14,52.4 72.14,51.51 71.56,50.93 60.27,50.93 | D13.C 24.71,50.93 41.35,50.93 | 41.35,50.93 60.2,50.93 60.27,50.93 | D12.C 41.35,50.93 | D11.C 60.27,50.93
ROW3
  Bottom 0.203: D14.C 24.71,31.5 41.35,31.5 | 41.35,31.5 60.14,31.5 | 60.14,31.5 74.93,31.5 75.69,32.26 75.69,35.94 65.15,46.48 65.15,49.28 66.29,50.42 72.01,50.42 72.69,51.1 72.69,51.74 73.79,52.83 74.04,52.83 75.73,54.52 U3.41 | D15.C 41.35,31.5 | 60.14,31.5 D16.C 60.45,29.08 62.99,26.54 66.55,26.54 68.64,24.46 D17.C
ROW4
  Bottom 0.203: D21.C 24.2,12.7 41.35,12.7 | 41.35,12.7 60.4,12.7 | 60.4,12.7 75.37,12.7 D18.C 75.95,21.34 77.85,23.24 77.85,35.69 69.72,43.81 69.72,46.35 73.23,49.86 73.23,51.38 75.97,54.12 U3.40 | D20.C 41.35,12.7 | D19.C 60.4,12.7
SCLK
  Bottom 0.203: U3.16 84.18,41.68 86.23,39.62 90.93,39.62 93.22,37.34 93.22,33.78 94,33 U$2.9
SD_CLK
  Bottom 0.203: U3.13 87.42,50.12 93.05,44.49 SD1.5
SD_CMD
  Bottom 0.203: U3.14 85.42,43.87 86.87,42.42 93.85,42.42 SD1.3
SD_D0
  Bottom 0.203: U3.12 88.8,50.52 92.63,46.69 SD1.7
USB_DN  (via drill 0.35, 0.5)
  Top 0.203: U2.A7 87.75,87.19 87.94,87 88.58,87 88.75,87.17 U2.B7 88.75,91.16 v88.77,91.19
  pwr 0.203: v88.77,91.19 88.77,54.3 v84.38,49.91
  Bottom 0.203: U3.25 80.58,49.59 80.77,49.78 84.25,49.78 v84.38,49.91
USB_DP  (via drill 0.35, 0.5)
  Top 0.203: U2.B6 87.25,89.54 v87.76,90.04 88.25,89.55 U2.A6
  pwr 0.203: v87.76,90.04 88.14,89.66 88.14,54.86 83.21,49.94 v79.55,49.94
  Bottom 0.203: v79.55,49.94 79.68,49.81 80.06,49.81 80.18,49.69 U3.26
WTF2
  cutout gnd: 81.53,7.37 109.73,7.37 109.73,-0.76 81.53,-0.76
  cutout pwr (no thermals): 81.03,7.62 109.73,7.62 109.73,-0.51 81.03,-0.51

### Text on the board
tNames: - | +
bNames: duckyPad Pro / PT3 / dekuNukem / JUN2024
tDocu: watch out for strapping pins / GPIO3 must have pull resistor, pull to high to free up JTAG pins? / / 3.5mm corner radius / / double check RESET jumper has NO PASTE